# EAGLE design Steuerung (EAGLE 9.6.2)

## Sheet 1 of 3: Controller / Display
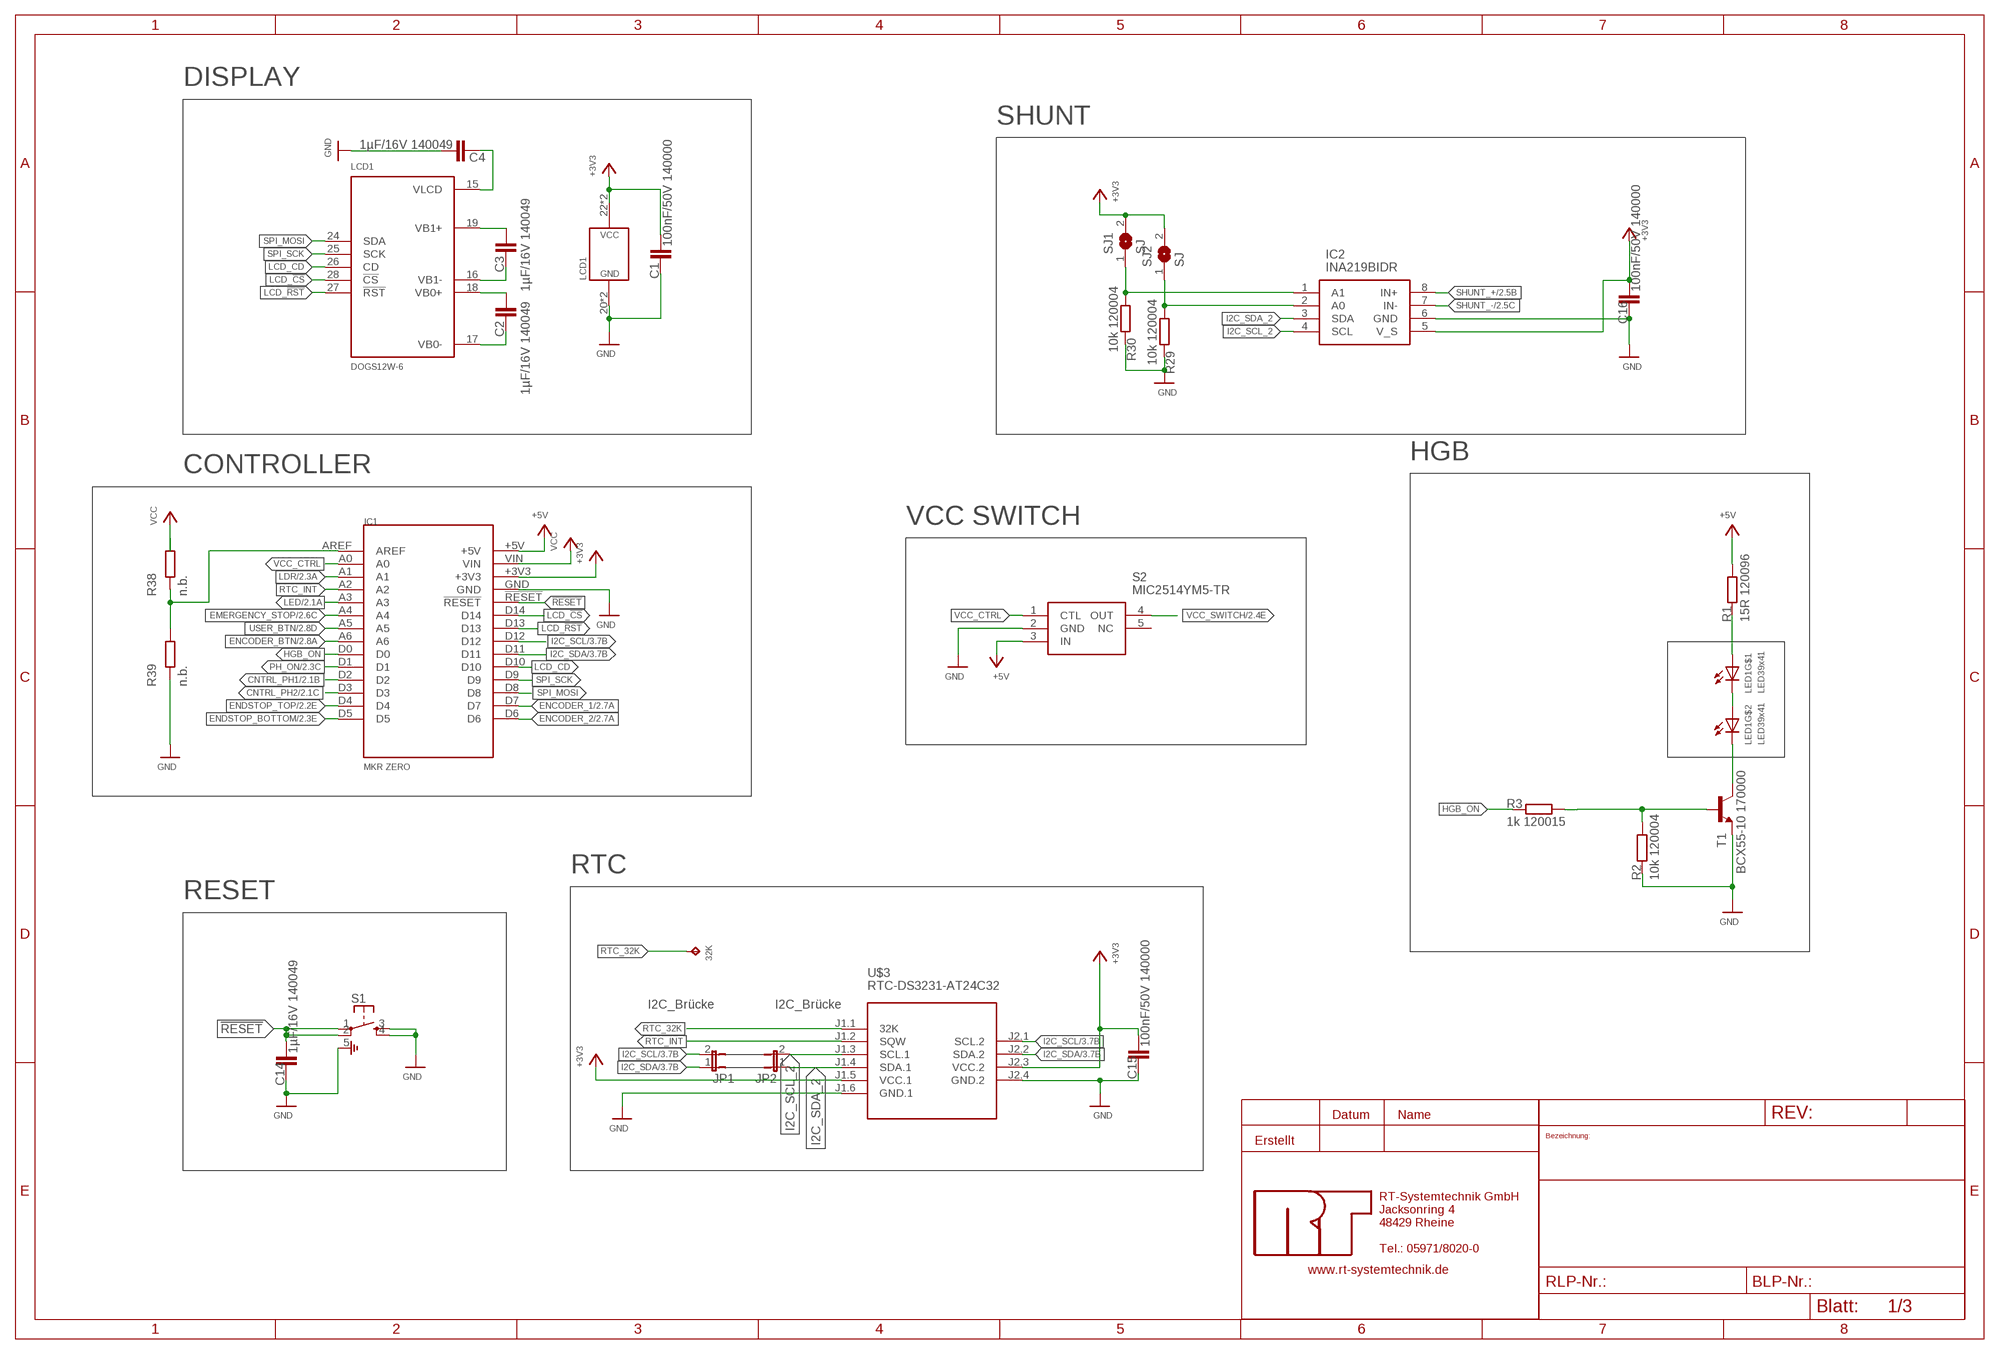
[diagram p0: schematic, sheet 1]

### Parts
32K  PAD_SMD_2,5X1  [SMD_2,5X1]
C1  100nF/50V 140000  C-EUC0805  [C0805]
C2  1µF/16V 140049  C-EUC0805  [C0805]
C3  1µF/16V 140049  C-EUC0805  [C0805]
C4  1µF/16V 140049  C-EUC0805  [C0805]
C14  1µF/16V 140049  C-EUC0805  [C0805]
C15  100nF/50V 140000  C-EUC0805  [C0805]
C16  100nF/50V 140000  C-EUC0805  [C0805]
FRAME1  A3L-LOC  [DOKUDATA]
IC1  MKR ZERO  MKR_ZERO  [MKR_ZERO]
IC2  INA219BIDR  [SOIC127P600X175-8N]
JP1  I2C_Brücke  JP1E  [JP1]
JP2  I2C_Brücke  JP1E  [JP1]
LCD1  DOGS12W-6  DOGS102-6  [DOGS_LCD_102X64]
LED1  LED39x41  LED39X41  [LED39X41]
R1  15R 120096  R-EU_R0805  [R0805]
R2  10k 120004  R-EU_R0805  [R0805]
R3  1k 120015  R-EU_R0805  [R0805]
R29  10k 120004  R-EU_R0805  [R0805]
R30  10k 120004  R-EU_R0805  [R0805]
R38  n.b.  R-EU_R0805  [R0805]
R39  n.b.  R-EU_R0805  [R0805]
S1  B3SN-3X12  [B3SN-3X12_SMD]
S2  MIC2514YM5-TR  [SOT95P280X130-5N]
SJ1  SJ  [SJ]
SJ2  SJ  [SJ]
T1  BCX55-10 170000  BCX55-NPN-SOT89-BCE  [SOT89-BCE]
U$3  RTC-DS3231-AT24C32  [RTC-DS3231-AT24C32]

### Nets
!RESET: C14.1 IC1.!RESET S1.1(P) S1.2(P1)
+3V3: C1.1 C15.1 C16.1 IC1.+3V3 IC2.5(V_S) LCD1.22(VCC) LCD1.23(VCC) SJ1.2 SJ2.2 U$3.J1.5(VCC.1) U$3.J2.3(VCC.2) ; also sheet 2,3
+5V: IC1.+5V R1.1 S2.3(IN) ; also sheet 2
CNTRL_PH1: IC1.D2 ; also sheet 2
CNTRL_PH2: IC1.D3 ; also sheet 2
EMERGENCY_STOP: IC1.A4 ; also sheet 2
ENCODER_1: IC1.D7 ; also sheet 2
ENCODER_2: IC1.D6 ; also sheet 2
ENCODER_BTN: IC1.A6 ; also sheet 2
ENDSTOP_BOTTOM: IC1.D5 ; also sheet 2
ENDSTOP_TOP: IC1.D4 ; also sheet 2
GND: C1.2 C4.1 C14.2 C15.2 C16.2 IC1.GND IC2.6(GND) LCD1.20(GND) LCD1.21(GND) R2.2 R29.1 R30.1 R39.2 S1.3(S) S1.4(S1) S1.5 S2.2(GND) T1.E U$3.J1.6(GND.1) U$3.J2.4(GND.2) ; also sheet 2,3
HGB_ON: IC1.D0 R3.2
I2C_SCL: IC1.D12 JP1.2 U$3.J2.1(SCL.2) ; also sheet 3
I2C_SCL_2: IC2.4(SCL) JP2.2 U$3.J1.3(SCL.1)
I2C_SDA: IC1.D11 JP1.1 U$3.J2.2(SDA.2) ; also sheet 3
I2C_SDA_2: IC2.3(SDA) JP2.1 U$3.J1.4(SDA.1)
LCD_!CS: IC1.D14 LCD1.28(!CS)
LCD_!RST: IC1.D13 LCD1.27(!RST)
LCD_CD: IC1.D10 LCD1.26(CD)
LDR: IC1.A1 ; also sheet 2
LED: IC1.A3 ; also sheet 2
N$3: C3.1 LCD1.19(VB1+)
N$4: C3.2 LCD1.16(VB1-)
N$5: C2.1 LCD1.18(VB0+)
N$6: C2.2 LCD1.17(VB0-)
N$7: C4.2 LCD1.15(VLCD)
N$8: LED1.2(C) LED1.14(A)
N$9: LED1.1(A) R1.2
N$10: LED1.13(C) T1.C
N$11: R2.1 R3.1 T1.B
N$24: IC2.1(A1) R30.2 SJ1.1
N$25: IC2.2(A0) R29.2 SJ2.1
N$34: IC1.AREF R38.2 R39.1
PH_ON: IC1.D1 ; also sheet 2
RTC_32K: 32K.PIN1(PAD) U$3.J1.1(32K)
RTC_INT: IC1.A2 U$3.J1.2(SQW)
SHUNT_+: IC2.8(IN+) ; also sheet 2
SHUNT_-: IC2.7(IN-) ; also sheet 2
SPI_MOSI: IC1.D8 LCD1.24(SDA)
SPI_SCK: IC1.D9 LCD1.25(SCK)
USER_BTN: IC1.A5 ; also sheet 2
VCC: IC1.VIN R38.1 ; also sheet 3
VCC_CTRL: IC1.A0 S2.1(CTL)
VCC_SWITCH: S2.4(OUT) ; also sheet 2
Unconnected: S2.5(NC)

### Notes on the sheet
- DISPLAY
- SHUNT
- HGB
- CONTROLLER
- VCC SWITCH
- RTC
- RESET

## Sheet 2 of 3: IO
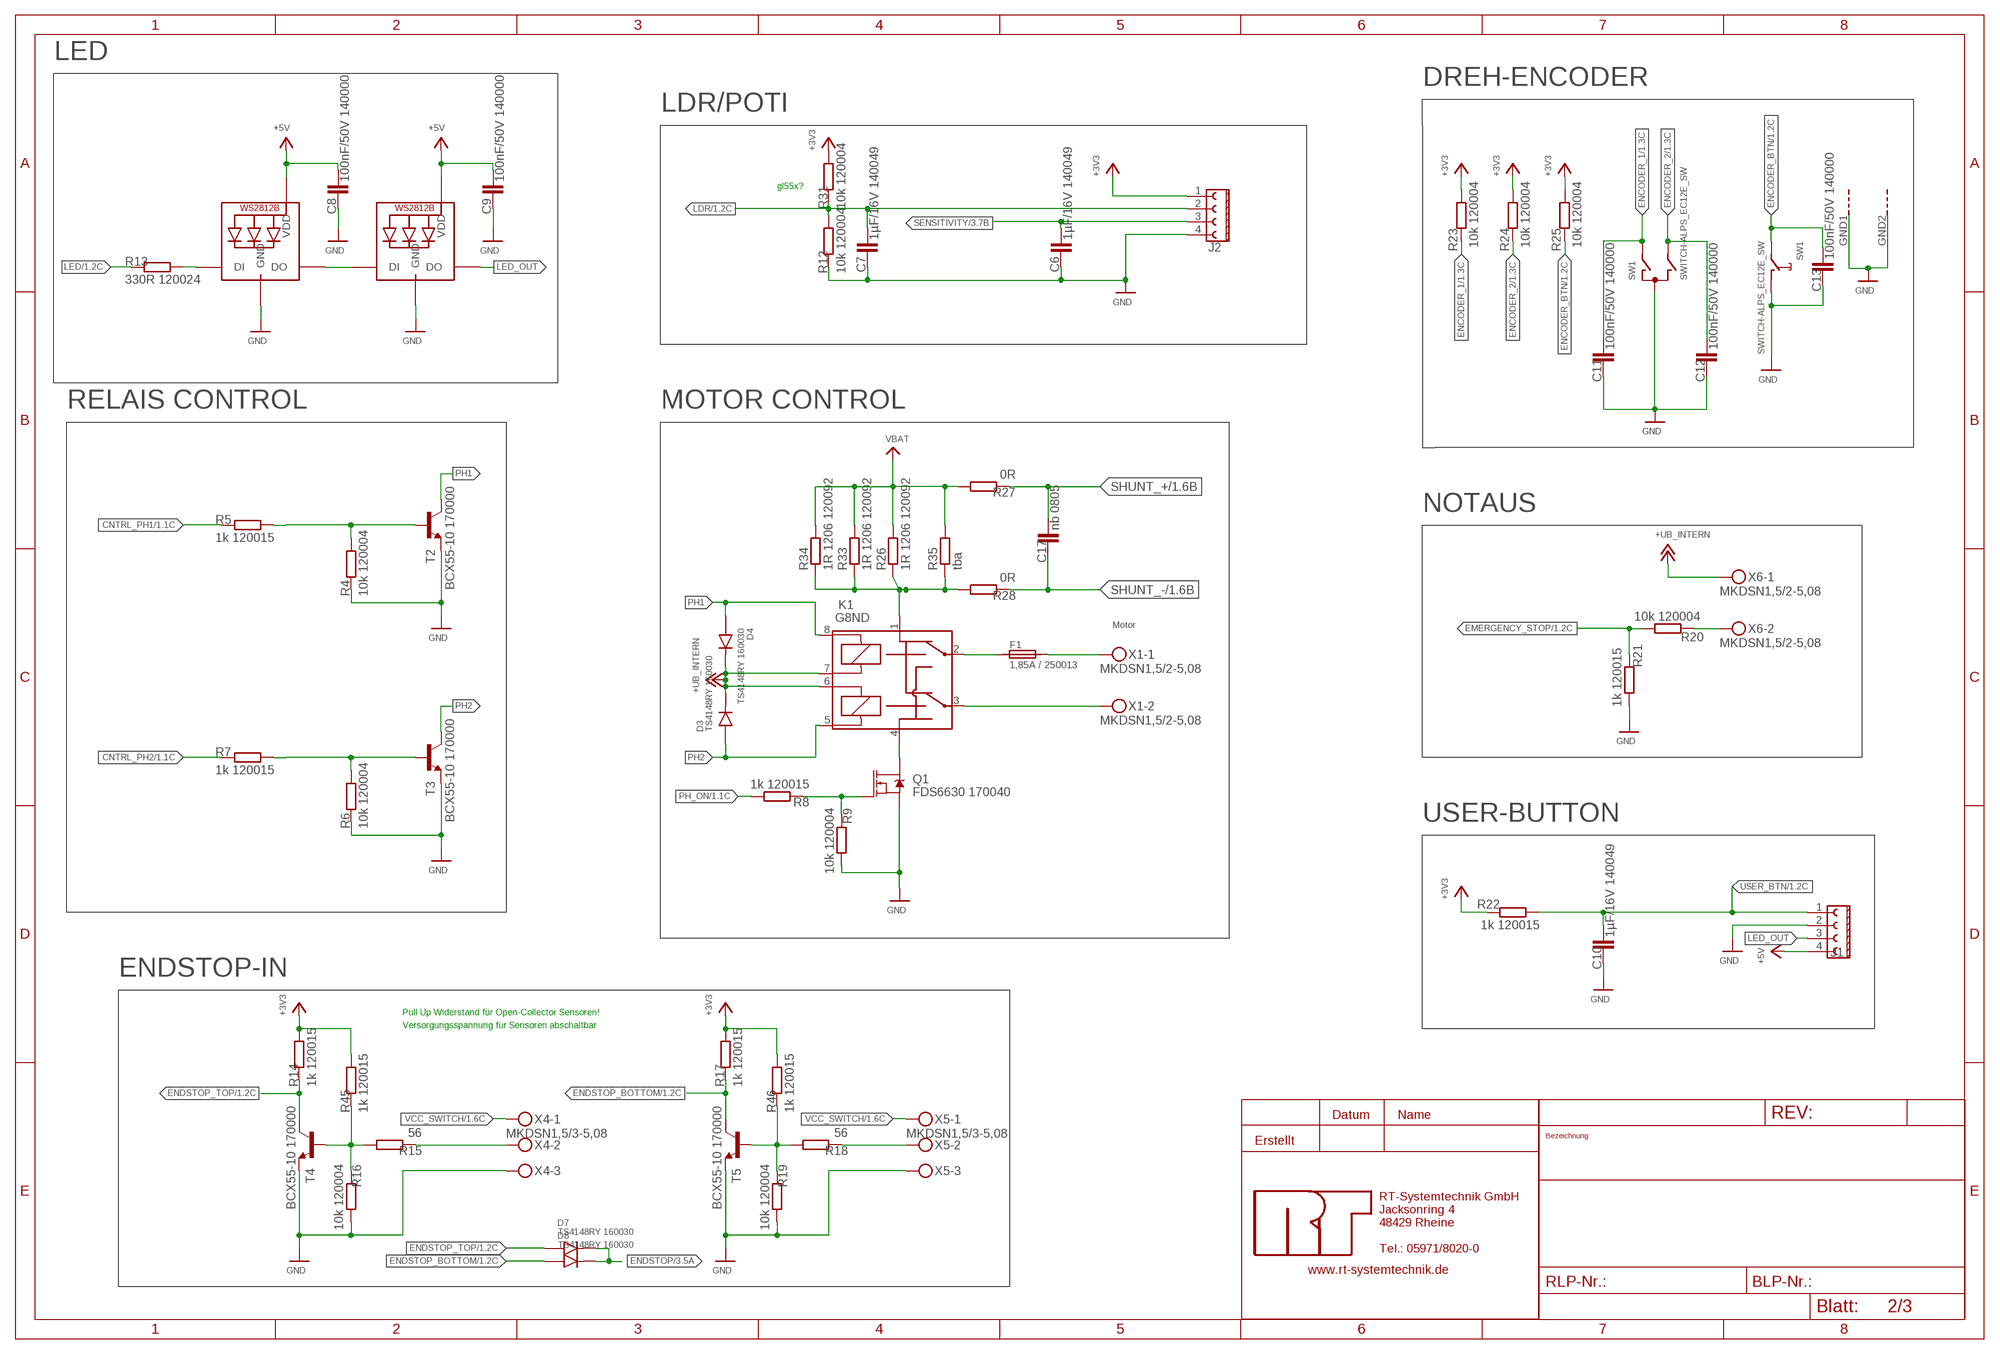
[diagram p1: schematic, sheet 2]

### Parts
C6  1µF/16V 140049  C-EUC0805  [C0805]
C7  1µF/16V 140049  C-EUC0805  [C0805]
C8  100nF/50V 140000  C-EUC0805  [C0805]
C9  100nF/50V 140000  C-EUC0805  [C0805]
C10  1µF/16V 140049  C-EUC0805  [C0805]
C11  100nF/50V 140000  C-EUC0805  [C0805]
C12  100nF/50V 140000  C-EUC0805  [C0805]
C13  100nF/50V 140000  C-EUC0805  [C0805]
C17  nb 0805  C-EUC0805  [C0805]
D3  TS4148RY 160030  TS4148RY  [R1206]
D4  TS4148RY 160030  TS4148RY  [R1206]
D7  TS4148RY 160030  TS4148RY  [R1206]
D8  TS4148RY 160030  TS4148RY  [R1206]
F1  1,85A / 250013  SMD_POLY_2920  [SMD2920]
FRAME2  A3L-LOC  [DOKUDATA]
J1  CONNECTORS_JST-4  [CONNECTORS_EXH_PRN_H_INV]
J2  CONNECTORS_JST-4  [CONNECTORS_EXH_PRN_H_INV]
K1  G8ND  RELAYS_OMRON_G8ND2  [RELAYS_OMRON_G8ND2]
LED2  WS2812B5050  [WS2812B]
LED3  WS2812B5050  [WS2812B]
Q1  FDS6630 170040  MOSFET-NCH-FDS6630A  [SO08]
R4  10k 120004  R-EU_R0805  [R0805]
R5  1k 120015  R-EU_R0805  [R0805]
R6  10k 120004  R-EU_R0805  [R0805]
R7  1k 120015  R-EU_R0805  [R0805]
R8  1k 120015  R-EU_R0805  [R0805]
R9  10k 120004  R-EU_R0805  [R0805]
R12  10k 120004  R-EU_R0805  [R0805]
R13  330R 120024  R-EU_R0805  [R0805]
R14  1k 120015  R-EU_R0805  [R0805]
R15  56  R-EU_R0805  [R0805]
R16  10k 120004  R-EU_R0805  [R0805]
R17  1k 120015  R-EU_R0805  [R0805]
R18  56  R-EU_R0805  [R0805]
R19  10k 120004  R-EU_R0805  [R0805]
R20  10k 120004  R-EU_R0805  [R0805]
R21  1k 120015  R-EU_R0805  [R0805]
R22  1k 120015  R-EU_R0805  [R0805]
R23  10k 120004  R-EU_R0805  [R0805]
R24  10k 120004  R-EU_R0805  [R0805]
R25  10k 120004  R-EU_R0805  [R0805]
R26  1R 1206 120092  R-EU_R1206W  [R1206W]
R27  0R  R-EU_R0805  [R0805]
R28  0R  R-EU_R0805  [R0805]
R31  10k 120004  R-EU_R0805  [R0805]
R33  1R 1206 120092  R-EU_R1206W  [R1206W]
R34  1R 1206 120092  R-EU_R1206W  [R1206W]
R35  tba  R-EU_0207/7  [0207/7]
R45  1k 120015  R-EU_R0805  [R0805]
R46  1k 120015  R-EU_R0805  [R0805]
SW1  SWITCH-ALPS_EC12E_SW  [SWITCH-ALPS_ALPS_EC12E_SW]
T2  BCX55-10 170000  BCX55-NPN-SOT89-BCE  [SOT89-BCE]
T3  BCX55-10 170000  BCX55-NPN-SOT89-BCE  [SOT89-BCE]
T4  BCX55-10 170000  BCX55-NPN-SOT89-BCE  [SOT89-BCE]
T5  BCX55-10 170000  BCX55-NPN-SOT89-BCE  [SOT89-BCE]
X1  MKDSN1,5/2-5,08  [MKDSN1,5/2-5,08]
X4  MKDSN1,5/3-5,08  [MKDSN1,5/3-5,08]
X5  MKDSN1,5/3-5,08  [MKDSN1,5/3-5,08]
X6  MKDSN1,5/2-5,08  [MKDSN1,5/2-5,08]

### Nets
+3V3: J2.1 R14.1 R17.1 R22.2 R23.1 R24.1 R25.1 R31.1 R45.1 R46.1 ; also sheet 1,3
+5V: C8.1 C9.1 J1.4 LED2.1-VDD(VDD) LED3.1-VDD(VDD) ; also sheet 1
+UB_INTERN: D3.2(C) D4.2(C) K1.6(2SA) K1.7(1SB) X6.1 ; also sheet 3
CNTRL_PH1: R5.2 ; also sheet 1
CNTRL_PH2: R7.2 ; also sheet 1
EMERGENCY_STOP: R20.1 R21.2 ; also sheet 1
ENCODER_1: C11.1 R23.2 SW1.A ; also sheet 1
ENCODER_2: C12.1 R24.2 SW1.B ; also sheet 1
ENCODER_BTN: C13.1 R25.2 SW1.E ; also sheet 1
ENDSTOP: D7.2(C) D8.2(C) ; also sheet 3
ENDSTOP_BOTTOM: D8.1(A) R17.2 T5.C ; also sheet 1
ENDSTOP_TOP: D7.1(A) R14.2 T4.C ; also sheet 1
GND: C6.2 C7.2 C8.2 C9.2 C10.2 C11.2 C12.2 C13.2 J1.2 J2.4 LED2.3-GND(GND) LED3.3-GND(GND) Q1.1(S) Q1.2(S) Q1.3(S) R4.2 R6.2 R9.1 R12.2 R16.1 R19.1 R21.1 SW1.C SW1.D SW1.GND1(G) SW1.GND2(G) T2.E T3.E T4.E T5.E X4.3 X5.3 ; also sheet 1,3
LDR: C7.1 J2.2 R12.1 R31.2 ; also sheet 1
LED: R13.2 ; also sheet 1
LED_OUT: J1.3 LED3.2-DOUT(DO)
N$1: K1.4(O2) Q1.5(D) Q1.6(D) Q1.7(D) Q1.8(D)
N$2: Q1.4(G) R8.2 R9.2
N$12: R4.1 R5.1 T2.B
N$13: R6.1 R7.1 T3.B
N$14: K1.3(P2) X1.2
N$15: F1.1 K1.2(P1)
N$16: F1.2 X1.1
N$18: LED2.4-DIN(DI) R13.1
N$19: LED2.2-DOUT(DO) LED3.4-DIN(DI)
N$20: R15.1 R16.2 R45.2 T4.B
N$21: R15.2 X4.2
N$22: R18.1 R19.2 R46.2 T5.B
N$23: R18.2 X5.2
N$26: K1.1(O1) R26.1 R28.1 R33.1 R34.1 R35.1
N$27: R20.2 X6.2
PH1: D4.1(A) K1.8(1SA) T2.C
PH2: D3.1(A) K1.5(2SB) T3.C
PH_ON: R8.1 ; also sheet 1
SENSITIVITY: C6.1 J2.3 ; also sheet 3
SHUNT_+: C17.1 R27.2 ; also sheet 1
SHUNT_-: C17.2 R28.2 ; also sheet 1
USER_BTN: C10.1 J1.1 R22.1 ; also sheet 1
VBAT: R26.2 R27.1 R33.2 R34.2 R35.2 ; also sheet 3
VCC_SWITCH: X4.1 X5.1 ; also sheet 1

### Notes on the sheet
- LED
- DREH-ENCODER
- LDR/POTI
- gl55x?
- RELAIS CONTROL | MOTOR CONTROL
- NOTAUS
- Motor
- USER-BUTTON
- ENDSTOP-IN
- Pull Up Widerstand für Open-Collector Sensoren!
- Versorgungsspannung für Sensoren abschaltbar

## Sheet 3 of 3: Power
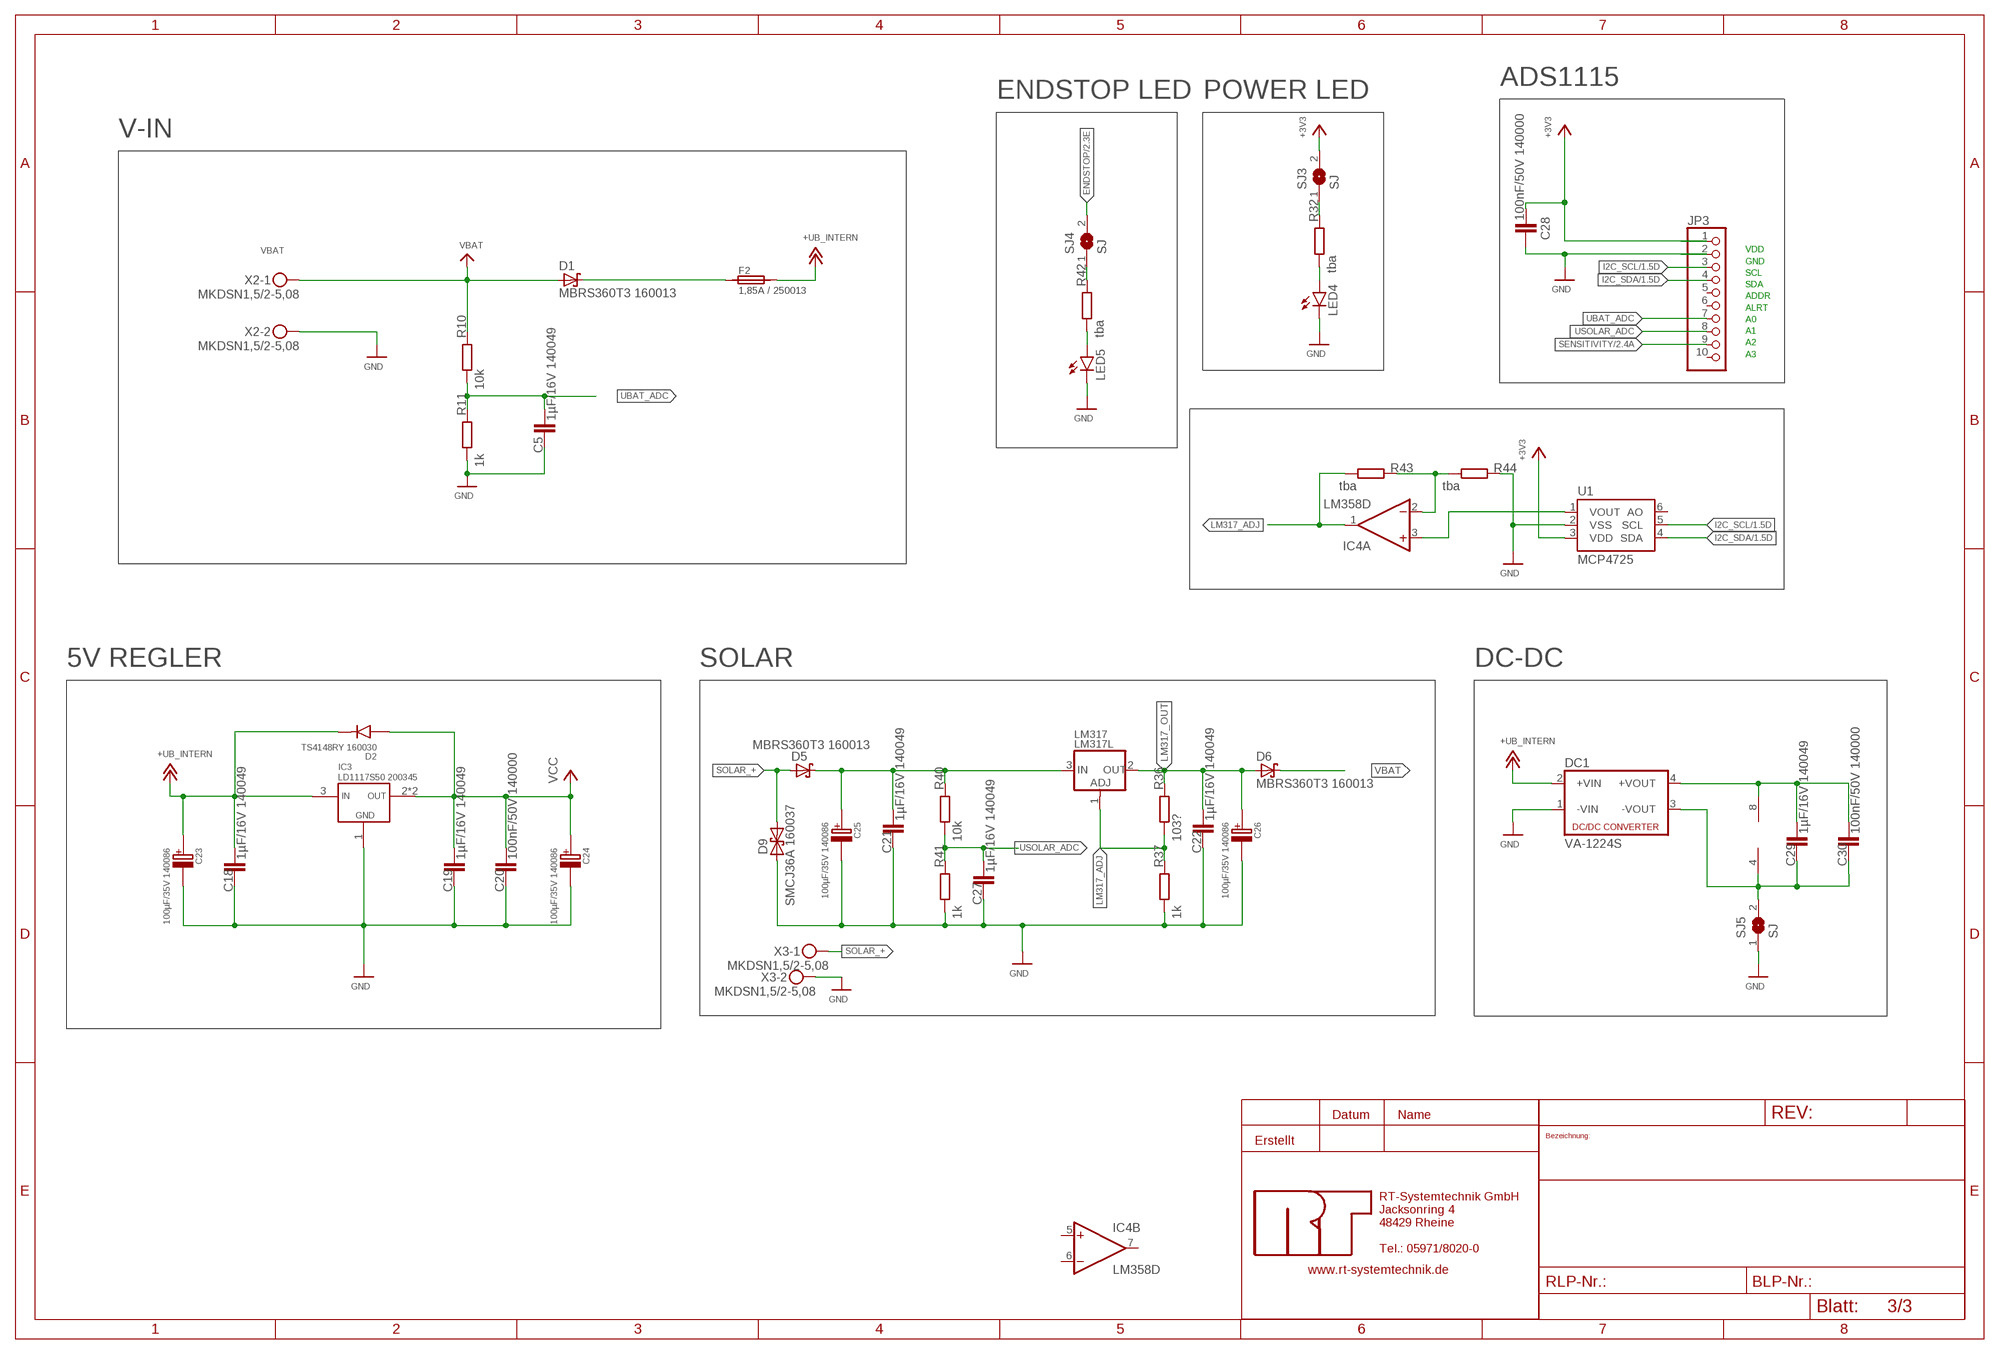
[diagram p2: schematic, sheet 3]

### Parts
C5  1µF/16V 140049  C-EUC0805  [C0805]
C18  1µF/16V 140049  C-EUC0805  [C0805]
C19  1µF/16V 140049  C-EUC0805  [C0805]
C20  100nF/50V 140000  C-EUC0805  [C0805]
C21  1µF/16V 140049  C-EUC0805  [C0805]
C22  1µF/16V 140049  C-EUC0805  [C0805]
C23  100µF/35V 140086  RCL_CPOL_E(CASE-D)-100UF/35V  [RCL_CE_D]
C24  100µF/35V 140086  RCL_CPOL_E(CASE-D)-100UF/35V  [RCL_CE_D]
C25  100µF/35V 140086  RCL_CPOL_E(CASE-D)-100UF/35V  [RCL_CE_D]
C26  100µF/35V 140086  RCL_CPOL_E(CASE-D)-100UF/35V  [RCL_CE_D]
C27  1µF/16V 140049  C-EUC0805  [C0805]
C28  100nF/50V 140000  C-EUC0805  [C0805]
C29  1µF/16V 140049  C-EUC0805  [C0805]
C30  100nF/50V 140000  C-EUC0805  [C0805]
D1  MBRS360T3 160013  ROLF_MBRS360T3  [ROLF_SMC]
D2  TS4148RY 160030  TS4148RY  [R1206]
D5  MBRS360T3 160013  ROLF_MBRS360T3  [ROLF_SMC]
D6  MBRS360T3 160013  ROLF_MBRS360T3  [ROLF_SMC]
D9  SMCJ36A 160037  SMCJ36CA  [SMC]
DC1  VA-1224S  [4SIL]
F2  1,85A / 250013  SMD_POLY_2920  [SMD2920]
FRAME3  A3L-LOC  [DOKUDATA]
IC3  LD1117S50 200345  SPANNUNGSREGLER_LD1117S50  [SPANNUNGSREGLER_SOT-223]
IC4  LM358D  [SO08]
JP3  PINHD-1X10  [1X10]
LED4  LEDCHIP-LED0805  [CHIP-LED0805]
LED5  LEDCHIP-LED0805  [CHIP-LED0805]
LM317  LM317L  [TO220L]
R10  10k  R-EU_R0805  [R0805]
R11  1k  R-EU_R0805  [R0805]
R32  tba  R-EU_R0805  [R0805]
R36  103?  R-EU_R0805  [R0805]
R37  1k  R-EU_R0805  [R0805]
R40  10k  R-EU_R0805  [R0805]
R41  1k  R-EU_R0805  [R0805]
R42  tba  R-EU_R0805  [R0805]
R43  tba  R-EU_R0805  [R0805]
R44  tba  R-EU_R0805  [R0805]
SJ3  SJ  [SJ]
SJ4  SJ  [SJ]
SJ5  SJ  [SJ]
U1  MCP4725  MCP4725SOT-23  [SOT23-6]
X2  MKDSN1,5/2-5,08  [MKDSN1,5/2-5,08]
X3  MKDSN1,5/2-5,08  [MKDSN1,5/2-5,08]

### Nets
+3V3: C28.1 JP3.1 SJ3.2 U1.3(VDD) ; also sheet 1,2
+UB_INTERN: C18.1 C23.+ D2.2(C) DC1.2(+VIN) F2.2 IC3.3(IN) ; also sheet 2
ENDSTOP: SJ4.2 ; also sheet 2
GND: C5.2 C18.2 C19.2 C20.2 C21.2 C22.2 C23.- C24.- C25.- C26.- C27.2 C28.2 D9.A DC1.1(-VIN) IC3.1(GND) JP3.2 LED4.C LED5.C R11.2 R37.2 R41.2 R44.1 U1.2(VSS) X2.2 X3.2 ; also sheet 1,2
I2C_SCL: JP3.3 U1.5(SCL) ; also sheet 1
I2C_SDA: JP3.4 U1.4(SDA) ; also sheet 1
LM317_ADJ: IC4.1(A:OUT) LM317.1(ADJ) R36.2 R37.1 R43.2
LM317_OUT: C22.1 C26.+ D6.A LM317.2(OUT) R36.1
N$17: D1.K F2.1
N$28: LED4.A R32.2
N$29: C21.1 C25.+ D5.K LM317.3(IN) R40.1
N$30: R32.1 SJ3.1
N$31: IC4.3(A:+IN) U1.1(VOUT)
N$32: LED5.A R42.2
N$33: R42.1 SJ4.1
N$35: C29.1 C30.1 DC1.4(+VOUT) IC4.8(P:V+)
N$36: IC4.2(A:-IN) R43.1 R44.2
N$37: C29.2 C30.2 DC1.3(-VOUT) IC4.4(P:V-) SJ5.2
N$38: SJ5.1 ; supply symbol labelled GND
SENSITIVITY: JP3.9 ; also sheet 2
SOLAR_+: D5.A D9.C X3.1
UBAT_ADC: C5.1 JP3.7 R10.2 R11.1
USOLAR_ADC: C27.1 JP3.8 R40.2 R41.1
VBAT: D1.A D6.K R10.1 X2.1 ; also sheet 2
VCC: C19.1 C20.1 C24.+ D2.1(A) IC3.2(OUT) IC3.4(OUT) ; also sheet 1
Unconnected: IC4.5(B:+IN) IC4.6(B:-IN) IC4.7(B:OUT) JP3.5 JP3.6 JP3.10 U1.6(AO)

### Notes on the sheet
- ADS1115
- ENDSTOP LED | POWER LED
- V-IN
- VBAT
- VDD
  GND
  SCL
  SDA
  ADDR
  ALRT
  A0
  A1
  A2
  A3
- 5V REGLER | SOLAR | DC-DC

## Library data of the parts
32K = Sonstiges:PAD_
C1-C22 C27-C30 = rcl:C-EU: CAPACITOR, European symbol; SPICEPREFIX: C
C23-C26 = Interface_Klimaschrank:RCL_CPOL_?-*: Kondensatoren, gepolt; RT: 140105; VALUE: 100µF/35V
D1 D5 D6 = DCU_Aktive_Erw:ROLF_MBRS360T3
D2-D4 D7 D8 = Fabian:TS4148RY
D9 = 67017:SMCJ36CA
DC1 = dc-dc-converter:VA-*?: DC DC Converter Single Output, 1 Watt Motien Technology Co.,Ltd. Source: va-serie.pdf; OC_FARNELL: unknown; OC_NEWARK: unknown
F1 F2 = Joerg_Sonstiges:SMD_POLY_2920
FRAME1-FRAME3 = RT:A3L-LOC: A3 Rahmen Querformat DIN A3, Querformat; ULP zum ausfüllen: DOCFIELD
IC1 = Fabian:MKR_ZERO
IC2 = SamacSys_Parts:INA219BIDR: 26-V, Bidirectional, Zero-Drift, High-Side, I2C Out Current/Power Monitor Source: Datasheet <https://www.ti.com/lit/ds/symlink/ina219.pdf?HQS=TI-null-null-digikeymode-df-pf-null-wwe&ts=1601223553719>; DESCRIPTION: 26-V, Bidirectional, Zero-Drift, High-Side, I2C Out Current/Power Monitor; HEIGHT: 1.75mm; MANUFACTURER_NAME: Texas Instruments; MANUFACTURER_PART_NUMBER: INA219BIDR; MOUSER_PART_NUMBER: 595-INA219BIDR; MOUSER_PRICE-STOCK: https://www.mouser.co.uk/ProductDetail/Texas-Instruments/INA219BIDR?qs=1WmUhT%2FVMINyGsXNJcdD5Q%3D%3D
IC3 = Interface_Klimaschrank:SPANNUNGSREGLER_LD1117?*
IC4 = linear:LM358: OP AMP also LM158; LM258; LM2904 Source: http://cache.national.com/ds/LM/LM158.pdf
J1 J2 = LCC2:CONNECTORS_JST-4: 4 pin JST connector
JP1 JP2 = jumper:JP1E: JUMPER
JP3 = pinhead:PINHD-1X10: PIN HEADER
K1 = LCC2:RELAYS_OMRON_G8ND2: OMRON relay
LCD1 = Optoelektronik:DOGS102-6: EADOGS102-6 mit Hintergrundbeleuchtung EA LED39X41-A
LED1 = Optoelektronik:LED39X41
LED2 LED3 = adafruit:WS2812B
LED4 LED5 = led:LED: LED OSRAM: - CHIPLED LG R971, LG N971, LY N971, LG Q971, LY Q971, LO R971, LY R971 LH N974, LH R974 LS Q976, LO Q976, LY Q976 LO Q996 - Hyper CHIPLED LW Q18S LB Q993, LB Q99A, LB R99A - SideLED LS A670, LO A670, LY A670, LG A670, LP A670 LB A673, LV A673, LT A673, LW A673 LH A674 LY A675 LS A676, LA A676, LO A676, LY A676, LW A676 LS A679, LY A679, LG A679 - Hyper Micro SIDELED® LS Y876, LA Y876, LO Y876, LY Y876 LT Y87S - SmartLED LW L88C, LW L88S LB L89C, LB L89S, LG L890 LS L89K, LO L89K, LY L89K LS L896, LA L896, LO L896, LY L896 - TOPLED LS T670, LO T670, LY T670, LG T670, LP T670 LSG T670, LSP T670, LSY T670, LOP T670, LYG T670 LG T671, LOG T671, LSG T671 LB T673, LV T673, LT T673, LW T673 LH T674 LS T676, LA T676, LO T676, LY T676, LB T676, LH T676, LSB T676, LW T676 LB T67C, LV T67C, LT T67C, LS T67K, LO T67K, LY T67K, LW E67C LS E67B, LA E67B, LO E67B, LY E67B, LB E67C, LV E67C, LT E67C LW T67C LS T679, LY T679, LG T679 LS T770, LO T770, LY T770, LG T770, LP T770 LB T773, LV T773, LT T773, LW T773 LH T774 LS E675, LA E675, LY E675, LS T675 LS T776, LA T776, LO T776, LY T776, LB T776 LHGB T686 LT T68C, LB T68C - Hyper Mini TOPLED® LB M676 - Mini TOPLED Santana® LG M470 LS M47K, LO M47K, LY M47K Source: http://www.osram.convergy.de LUXEON: - LUMILED® LXK2-PW12-R00, LXK2-PW12-S00, LXK2-PW14-U00, LXK2-PW14-V00 LXK2-PM12-R00, LXK2-PM12-S00, LXK2-PM14-U00 LXK2-PE12-Q00, LXK2-PE12-R00, LXK2-PE12-S00, LXK2-PE14-T00, LXK2-PE14-U00 LXK2-PB12-K00, LXK2-PB12-L00, LXK2-PB12-M00, LXK2-PB14-N00, LXK2-PB14-P00, LXK2-PB14-Q00 LXK2-PR12-L00, LXK2-PR12-M00, LXK2-PR14-Q00, LXK2-PR14-R00 LXK2-PD12-Q00, LXK2-PD12-R00, LXK2-PD12-S00 LXK2-PH12-R00, LXK2-PH12-S00 LXK2-PL12-P00, LXK2-PL12-Q00, LXK2-PL12-R00 Source: www.luxeon.com KINGBRIGHT: KA-3528ASYC Source: www.kingbright.com
LM317 = ic:LM317: LM317: Adjustable voltage regulator 3 pins, 1.2-37V, 1.5A (SMD version: 0.5A)
Q1 = SparkFun-DiscreteSemi:MOSFET-NCH: N-channel MOSFETs Voltage controlled devices that allow control of high current outputs. SparkFun Products: SparkFun OpenScale <https://www.sparkfun.com/products/13261> SparkFun Digital Sandbox <https://www.sparkfun.com/products/12651> SparkFun Monster Moto Shield <https://www.sparkfun.com/products/10182> SparkFun MOSFET Power Controller <https://www.sparkfun.com/products/11214>; PROD_ID: TRANS-08089; VALUE: 6.5A/30V/38mΩ
R1-R46 = rcl:R-EU_: RESISTOR, European symbol; SPICEPREFIX: R
S1 = Joerg_Schalter&Taster:B3SN-3X12
S2 = SamacSys_Parts:MIC2514YM5-TR: MICROCHIP - MIC2514YM5-TR - IC, SWITCH, HIGH SIDE, TTL INPUT Source: Datasheet <https://componentsearchengine.com/Datasheets/2/MIC2514YM5-TR.pdf>; DESCRIPTION: MICROCHIP - MIC2514YM5-TR - IC, SWITCH, HIGH SIDE, TTL INPUT; HEIGHT: 1.3mm; MANUFACTURER_NAME: Microchip; MANUFACTURER_PART_NUMBER: MIC2514YM5-TR; MOUSER_PART_NUMBER: 998-MIC2514YM5TR; MOUSER_PRICE-STOCK: https://www.mouser.co.uk/ProductDetail/Microchip-Technology-Micrel/MIC2514YM5-TR?qs=Y3Q3JoKAO1Tdv7qkmPTpGQ%3D%3D
SJ1-SJ5 = jumper:SJ: SMD solder JUMPER
SW1 = Interface_Klimaschrank:SWITCH-ALPS_EC12E_SW: ALPS rotary Encoder EC12E series with switch; MPN: EC12E2424407; OC_FARNELL: 1520813; OC_NEWARK: 74M1068
T1-T5 = transistor:*-NPN-: NPN Transistror BF959 corrected 2008.03.06
U1 = SparkFun-IC-Conversion:MCP4725: MCP4725 DAC Microchip 12-bit I2C DAC, SOT23-6 Datasheet <https://cdn.sparkfun.com/datasheets/BreakoutBoards/MCP4725_2009.pdf> SparkFun Products SparkFun I2C DAC Breakout - MCP4725 <https://www.sparkfun.com/products/12918> (BOB-12918); PROD_ID: IC-08886
U$3 = diy-modules:RTC-DS3231-AT24C32: RTC Module with Battery and EEPROM based on DS3231 and AT24C32 chips Tutorial can be found here: https://edwardmallon.wordpress.com/2014/05/21/using-a-cheap-3-ds3231-rtc-at24c32-eeprom-from-ebay/ Click here to find device on ebay.com <http://www.ebay.com/sch/DS3231+AT24C32+module>
X1-X3 X6 = con-phoenix-508:MKDSN1,5/2-5,08: MKDSN 1,5/ 2-5,08 Printklemme Nennstrom: 13,5 A Nennspannung: 250 V Rastermaß: 5,08 mm Polzahl: 2 Anschlussart: Schraubanschluss Montage: Löten Anschlussrichtung Leiter/Platine: 0 ° Artikelnummer: 1729128 Source: http://eshop.phoenixcontact.com .. 1729128.pdf
X4 X5 = con-phoenix-508:MKDSN1,5/3-5,08: MKDSN 1,5/ 3-5,08 Printklemme Nennstrom: 13,5 A Nennspannung: 250 V Rastermaß: 5,08 mm Polzahl: 3 Anschlussart: Schraubanschluss Montage: Löten Anschlussrichtung Leiter/Platine: 0 ° Artikelnummer: 1729131 Source: http://eshop.phoenixcontact.com .. 1729131.pdf

## Board
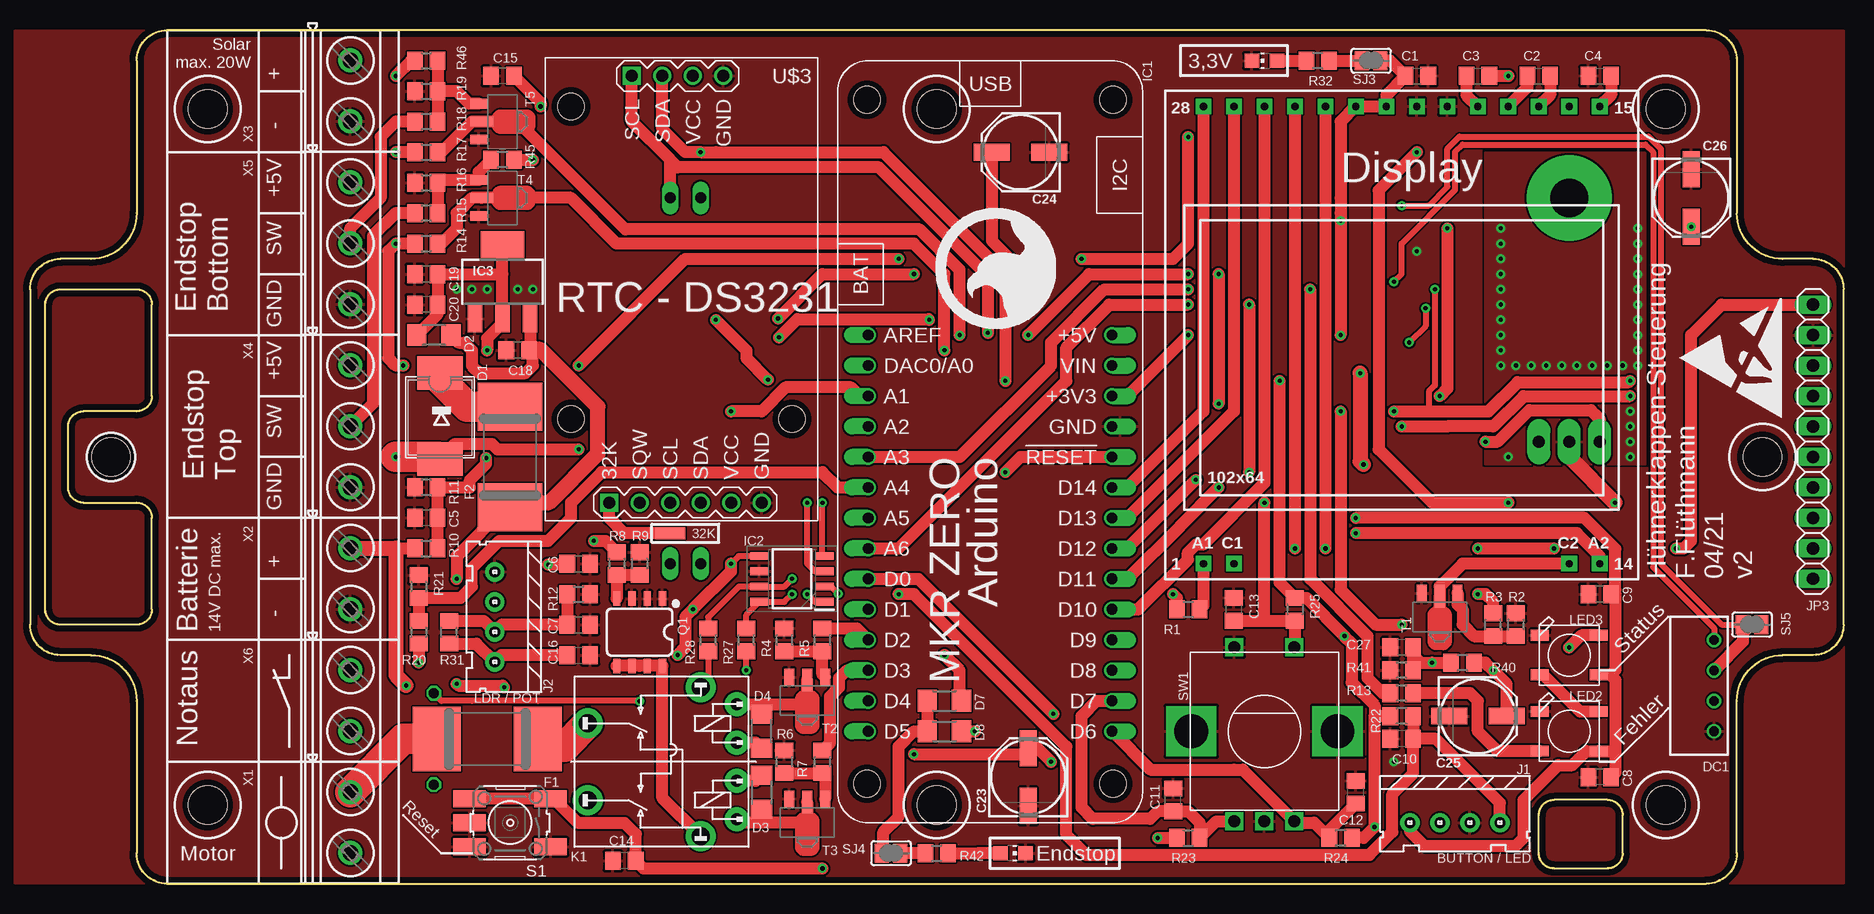
[diagram p3: board, top side]
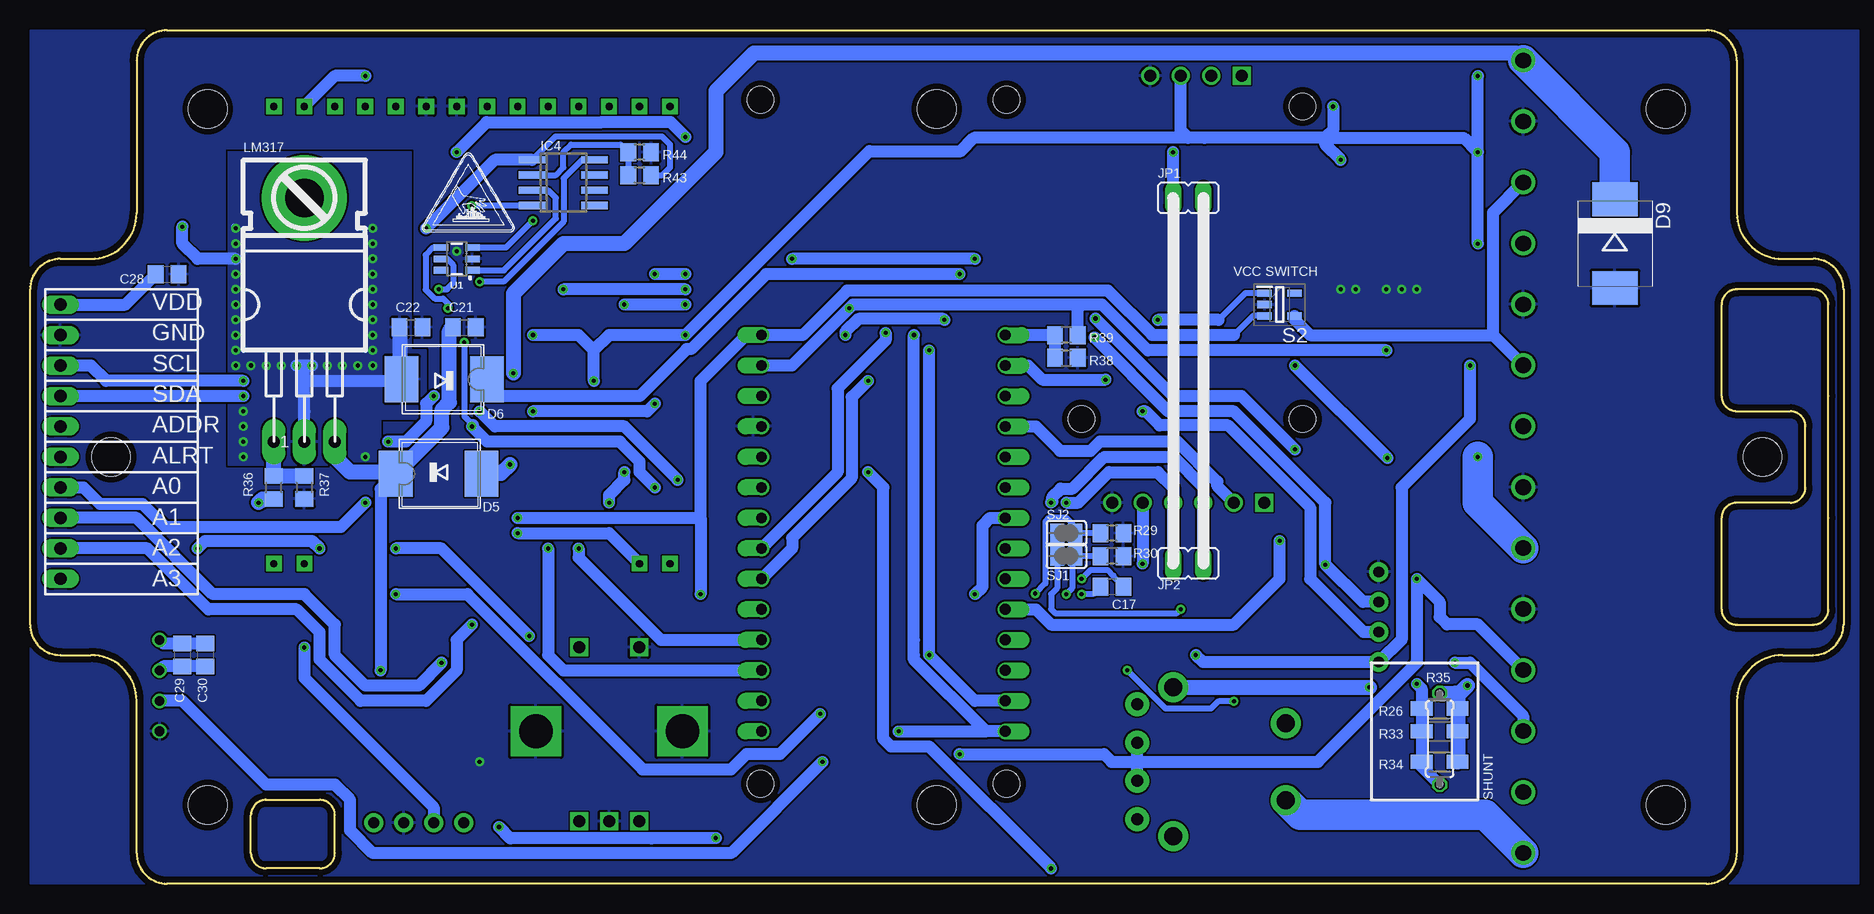
[diagram p4: board, bottom side, seen from below]

Size 151.13 x 71.12 mm. Coordinates in mm from the lower left corner, seen from the top.
Outline: 11.43,0 139.7,0 arc90 142.24,2.54 142.24,15.24 arc-90 146.05,19.05 148.59,19.05 arc90 151.13,21.59 151.13,49.53 arc90 148.59,52.07 146.05,52.07 arc-90 142.24,55.88 142.24,68.58 arc90 139.7,71.12 11.43,71.12 arc90 8.89,68.58 8.89,55.88 arc-90 5.08,52.07 2.54,52.07 arc90 0,49.53 0,21.59 arc90 2.54,19.05 5.08,19.05 arc-90 8.89,15.24 8.89,2.54 arc90 11.43,0
Outline: 8.89,21.59 2.54,21.59 arc-90 1.27,22.86 1.27,30.48 1.27,40.64 1.27,48.26 arc-90 2.54,49.53 8.89,49.53 arc-90 10.16,48.26 10.16,40.64 arc-90 8.89,39.37 4.45,39.37 arc90 3.17,38.1 3.17,33.02 arc90 4.45,31.75 8.89,31.75 arc-90 10.16,30.48 10.16,22.86 arc-90 8.89,21.59
Outline: 125.73,5.71 arc-90 127,6.99 131.44,6.99 arc-90 132.72,5.71 132.72,2.54 arc-90 131.44,1.27 127,1.27 arc-90 125.73,2.54 125.73,5.71
Copper layers (1*16): Top 0.018mm / dielectric 1.55mm / Bottom 0.018mm
Design rules "Standard_2Layer": minimum track width 0.15mm, minimum drill 0.25mm, track to track 0.15mm, track to pad 0.15mm, pad to pad 0.15mm, via to via 0.15mm, smd to smd 0mil, copper to edge 0.5mm, drill to drill 0.35mm, minimum pad ring 0.175mm, minimum via ring 0.2mm, stop-mask expansion 0mil, vias tented up to drill 0.4mm, thermal gap 0.2mm
Holes 3.2 mm at 6.75,35.56 144.38,35.56 136.31,64.56 75.56,6.56 75.56,64.56 14.81,64.56 14.81,6.56 136.31,6.56

### Footprints (pad centres in the part's own frame; a part is rotated, then mirrored left to right if it is on the bottom)
SMD_2,5X1 = smd 2.5 x 1: PIN1 0,0
C0805 = smd 1.3 x 1.5: 1 -0.95,0; 2 0.95,0
RCL_CE_D = smd 3 x 1.4: + 2.4,0; - -2.4,0
ROLF_SMC = smd 2.794 x 3.81: A 3.327,-0.127; K -3.81,-0.127
R1206 = smd 1.6 x 1.803: 1 -1.422,0; 2 1.422,0
SMC = smd 2.8 x 3.8: A 3.7,0; C -3.7,0
4SIL = drill 0.8: 1 -3.81,0; 2 -1.27,0; 3 1.27,0; 4 3.81,0
SMD2920 = smd 4 x 5.4: 1 -4.2,0; 2 4.2,0
MKR_ZERO = drill 0.9 offset: !RESET 1.27,10.16; +3V3 -3.81,10.16; +5V -8.89,10.16; A0 -6.35,-10.16; A1 -3.81,-10.16; A2 -1.27,-10.16; A3 1.27,-10.16; A4 3.81,-10.16; A5 6.35,-10.16; A6 8.89,-10.16; AREF -8.89,-10.16; D0 11.43,-10.16; D1 13.97,-10.16; D2 16.51,-10.16; D3 19.05,-10.16; D4 21.59,-10.16; D5 24.13,-10.16; D6 24.13,10.16; D7 21.59,10.16; D8 19.05,10.16; D9 16.51,10.16; D10 13.97,10.16; D11 11.43,10.16; D12 8.89,10.16; D13 6.35,10.16; D14 3.81,10.16; GND -1.27,10.16; VIN -6.35,10.16 | hole 2.2: -28.5,-10.25; 28.5,-10.25; 28.5,10.25; -28.5,10.25
SOIC127P600X175-8N = smd 1.528 x 0.65: 1 -2.711,1.905; 2 -2.711,0.635; 3 -2.711,-0.635; 4 -2.711,-1.905; 5 2.711,-1.905; 6 2.711,-0.635; 7 2.711,0.635; 8 2.711,1.905
SPANNUNGSREGLER_SOT-223 = smd 1.2 x 2.25: 1 -2.3,-3.1; 2 0,-3.1; 3 2.3,-3.1 | smd 3.6 x 2.2: 4 0,3.099
SO08 = smd 0.6 x 2.2: 1 -1.905,-2.6; 2 -0.635,-2.6; 3 0.635,-2.6; 4 1.905,-2.6; 5 1.905,2.6; 6 0.635,2.6; 7 -0.635,2.6; 8 -1.905,2.6
CONNECTORS_EXH_PRN_H_INV = drill 0.9 pad 1.6: 1 -3.75,0; 2 -1.25,0; 3 1.25,0; 4 3.75,0
JP1 = drill 0.914 long: 1 0,-1.27; 2 0,1.27
1X10 = drill 1.016 long: 1 -11.43,0; 2 -8.89,0; 3 -6.35,0; 4 -3.81,0; 5 -1.27,0; 6 1.27,0; 7 3.81,0; 8 6.35,0; 9 8.89,0; 10 11.43,0
RELAYS_OMRON_G8ND2 = drill 1.5 pad 2.5: 1 0,-6.2; 2 9.4,-3.2; 3 9.4,3.2; 4 0,6.2 | drill 1 pad 2: 5 -3,4.8; 6 -3,1.6; 7 -3,-1.6; 8 -3,-4.8
DOGS_LCD_102X64 = drill 0.6 pad 1.3 square: 15 16.51,21.59; 16 13.97,21.59; 17 11.43,21.59; 18 8.89,21.59; 19 6.35,21.59; 20 3.81,21.59; 21 1.27,21.59; 22 -1.27,21.59; 23 -3.81,21.59; 24 -6.35,21.59; 25 -8.89,21.59; 26 -11.43,21.59; 27 -13.97,21.59; 28 -16.51,21.59
LED39X41 = drill 0.6 pad 1.3 square: 1 -16.51,-16.51; 2 -13.97,-16.51; 13 13.97,-16.51; 14 16.51,-16.51
WS2812B = smd 1.5 x 0.9: 1-VDD 2.45,-1.65; 2-DOUT 2.45,1.65; 3-GND -2.45,1.65; 4-DIN -2.45,-1.65
CHIP-LED0805 = smd 1.2 x 1.2: A 0,-1.05; C 0,1.05
TO220L = drill 0.991 pad 1.905 long: 1 -2.54,0; 2 0,0; 3 2.54,0 | drill 3.2 pad 7.112: CASE 0,20.32
SO08' = smd 0.6 x 1.2: 1 -1.905,-2.8; 2 -0.635,-2.8; 3 0.635,-2.8; 4 1.905,-2.8; 5 1.905,2.8; 6 0.635,2.8; 7 -0.635,2.8; 8 -1.905,2.8
R0805 = smd 1.3 x 1.5: 1 -0.95,0; 2 0.95,0
R1206W = smd 1.8 x 1.2: 1 -1.499,0; 2 1.499,0
0207/7 = drill 0.813 octagon: 1 -3.81,0; 2 3.81,0
B3SN-3X12_SMD = smd 2.7 x 1.4: 1 3.375,-2; 2 -3.375,-2; 3 3.375,2; 4 -3.375,2; 5 3.375,0
SOT95P280X130-5N = smd 1.2 x 0.6: 1 -1.25,0.95; 2 -1.25,0; 3 -1.25,-0.95; 4 1.25,-0.95; 5 1.25,0.95
SJ = smd 1.168 x 1.6: 1 -0.762,0; 2 0.762,0
SWITCH-ALPS_ALPS_EC12E_SW = drill 1 square: A -2.5,-7.5; B 2.5,-7.5; C 0,-7.5; D -2.5,7; E 2.5,7 | drill 2.8 square: GND1 -6.1,0; GND2 6.1,0
SOT89-BCE = smd 0.8 x 1.4: B -1.499,-1.981; E 1.499,-1.981 | smd 0.8 x 1.9: C 0,-1.727
SOT23-6 = smd 0.55 x 1.2: 1 0.95,1.3; 2 0,1.3; 3 -0.95,1.3; 4 -0.95,-1.3; 5 0,-1.3; 6 0.95,-1.3
RTC-DS3231-AT24C32 = drill 1 square: J1.1 -17.78,6.35; J2.1 17.78,4.445 | drill 1: J1.2 -17.78,3.81; J1.3 -17.78,1.27; J1.4 -17.78,-1.27; J1.5 -17.78,-3.81; J1.6 -17.78,-6.35; J2.2 17.78,1.905; J2.3 17.78,-0.635; J2.4 17.78,-3.175 | hole 2.2: -10.795,-8.89; -10.795,9.525; 15.24,9.525
MKDSN1,5/2-5,08 = drill 1.3 pad 2: 1 -2.561,0.025; 2 2.519,0.025
MKDSN1,5/3-5,08 = drill 1.3 pad 2: 1 -7.641,0.025; 2 -2.561,0.025; 3 2.519,0.025

### Placement (x,y rotation side)
32K  53.34,29.21 180 top
C1  115.57,67.31 0 top
C2  125.73,67.31 0 top
C3  120.65,67.31 0 top
C4  130.81,67.31 0 top
C5  33.02,30.48 180 top
C6  45.72,26.67 0 top
C7  45.72,21.59 0 top
C8  130.81,8.89 180 top
C9  130.81,24.13 180 top
C10  114.3,12.06 180 top
C11  95.25,6.99 90 top
C12  110.49,7.62 90 top
C13  100.33,22.86 90 top
C14  49.53,1.91 180 top
C15  39.37,67.31 180 top
C16  45.72,19.05 0 top
C17  60.96,24.77 0 bottom
C18  40.64,44.45 180 top
C19  33.02,50.8 180 top
C20  33.02,48.26 180 top
C21  114.94,46.35 0 bottom
C22  119.38,46.35 0 bottom
C23  83.19,8.89 90 top
C24  82.55,60.96 180 top
C25  120.65,13.97 0 top
C26  138.43,57.15 270 top
C27  114.3,19.68 180 top
C28  139.7,50.8 0 bottom
C29  138.43,19.05 270 bottom
C30  136.53,19.05 270 bottom
D1  34.29,38.73 270 top
D2  33.66,45.72 0 top
D3  60.96,7.62 90 top
D4  60.96,12.7 270 top
D5  116.84,34.29 0 bottom
D6  116.84,41.91 180 bottom
D7  76.2,15.24 180 top
D8  76.2,12.7 180 top
D9  19.05,53.34 270 bottom
DC1  140.34,16.51 90 top
F1  38.1,12.06 180 top
F2  40.01,35.56 270 top
FRAME1  0,5.08 0 top
FRAME2  0,8.89 0 top
FRAME3  0,3.81 0 top
IC1  80.01,36.83 270 top
IC2  63.5,25.4 180 top
IC3  39.37,50.16 0 top
IC4  106.68,58.42 270 bottom
J1  118.75,5.08 180 top
J2  38.73,22.23 90 top
JP1  54.61,57.15 270 bottom
JP2  54.61,26.67 270 bottom
JP3  148.59,36.83 270 top
K1  55.88,10.16 180 top
LCD1  114.3,43.18 0 top
LED1  114.3,43.18 0 top
LED2  128.27,12.7 0 top
LED3  128.27,19.05 0 top
LED4  102.87,68.58 90 top
LED5  81.92,2.54 270 top
LM317  128.27,36.83 0 bottom
Q1  FDS6630 170040  [SO08']  50.8,20.95 180 top
R1  96.52,22.86 0 top
R2  123.83,21.59 90 top
R3  121.92,21.59 90 top
R4  62.87,20.32 90 top
R5  66.04,20.32 90 top
R6  62.87,10.16 90 top
R7  66.04,10.16 90 top
R8  48.9,26.67 270 top
R9  50.8,26.67 270 top
R10  33.02,27.94 0 top
R11  33.02,33.02 180 top
R12  45.72,24.13 0 top
R13  114.3,15.88 180 top
R14  33.02,53.34 0 top
R15  33.02,55.88 180 top
R16  33.02,58.42 0 top
R17  33.02,60.96 0 top
R18  33.02,63.5 180 top
R19  33.02,66.04 0 top
R20  32.38,20.95 270 top
R21  32.38,24.77 270 top
R22  114.3,13.97 180 top
R23  96.52,3.81 0 top
R24  109.22,3.81 180 top
R25  105.41,22.86 270 top
R26  33.66,14.61 0 bottom
R27  59.69,20.32 90 top
R28  56.52,20.32 90 top
R29  60.96,29.21 180 bottom
R30  60.96,27.3 180 bottom
R31  34.92,20.95 90 top
R32  107.31,68.58 180 top
R33  33.66,12.7 0 bottom
R34  33.66,10.16 0 bottom
R35  33.66,12.06 90 bottom
R36  130.81,33.02 90 bottom
R37  128.27,33.02 270 bottom
R38  64.77,45.72 180 bottom
R39  64.77,43.81 0 bottom
R40  119.38,18.41 180 top
R41  114.3,17.78 180 top
R42  75.56,2.54 0 top
R43  100.33,59.05 0 bottom
R44  100.33,60.96 180 bottom
R45  39.37,60.33 180 top
R46  33.02,68.58 0 top
S1  40.01,5.08 180 top
S2  46.99,48.26 0 bottom
SJ1  64.77,27.3 180 bottom
SJ2  64.77,29.21 180 bottom
SJ3  111.76,68.58 0 top
SJ4  71.75,2.54 180 top
SJ5  143.51,21.59 180 top
SW1  102.87,12.7 0 top
T1  117.47,22.23 180 top
T2  64.77,15.24 180 top
T3  64.77,5.08 180 top
T4  39.37,57.15 270 top
T5  39.37,63.5 270 top
U1  115.57,52.07 270 bottom
U$3  54.61,49.53 90 top
U$4  [ESD_10.00]  146.05,38.73 90 top
U$5  [CS-2016-LOGO-10MM]  73.66,44.45 0 top
X1  26.67,5.08 270 top
X2  26.67,25.4 270 top
X3  26.67,66.04 270 top
X4  26.67,35.56 270 top
X5  26.67,50.8 270 top
X6  26.67,15.24 270 top

### Tracks (layer width: path | path; a pad name or v marks a point on that pad's centre or on a via)
!RESET  (via drill 0.35)
  Top 1.016: v81.28,34.29 82.55,35.56 IC1.!RESET | S1.1 S1.2 43.66,7.08 45.69,5.05 49.56,5.05 50.48,4.13 C14.1 51.12,1.27 v66.04,1.27
  Bottom 1.016: v81.28,34.29 80.01,33.02 80.01,12.06 79.38,11.43 76.2,11.43 v66.04,1.27
+3V3  (via drill 0.35)
  Top 0.508: IC2.5 59.05,27.3 v58.42,26.67
  Top 1.016: R14.1 v30.48,53.34 29.84,52.7 29.84,43.81 30.48,43.18 v31.11,43.18 | R17.1 v30.48,60.96 | v93.98,3.81 R23.1 | v104.14,41.91 104.14,25.08 R25.1 106.36,23.81 v109.54,20.64 110.14,20.04 110.14,16.76 112.04,14.85 112.04,13.97 | C15.1 42.55,65.08 v42.55,64.77 | v53.98,19.05 54.61,19.68 54.61,22.23 v55.24,22.86 58.42,26.04 v58.42,26.67 | C16.1 39.31,19.05 J2.1 37.2,20 R31.1 | R24.1 111.12,3.81 v112.04,4.73 112.04,13.97 | R22.2 112.04,13.97 | IC1.+3V3 91.44,40.64 v96.52,45.72 | v109.22,45.72 v109.22,55.24 109.22,55.88 109.22,57.15 109.22,63.5 LCD1.23 LCD1.22 113.03,65.72 C1.1 113.35,68.58 SJ3.2 | v120.65,27.94 v127,27.94 | v137.16,27.94 137.79,27.94 138.43,28.57 138.43,45.72 140.97,48.26 JP3.1 | v30.48,67.31 31.75,68.58 R46.1 | R45.1 v41.91,60.33
  Bottom 0.508: SJ1.2 65.53,24.64 66.04,24.13 66.04,22.88 65.71,22.55 55.55,22.55 v55.24,22.86 | U1.3 111.44,53.02 v109.22,55.24
  Bottom 1.016: v30.48,53.34 v30.48,60.96 | 43.18,62.15 31.67,62.15 v30.48,60.96 | 43.18,62.15 53.26,62.15 54.61,62.15 | v93.98,3.81 99.32,3.81 99.34,3.79 111.1,3.79 v112.04,4.73 | 104.14,44.45 105.41,45.72 v109.22,45.72 | v31.11,43.18 31.11,38.73 36.83,33.02 36.83,20.32 38.67,18.48 | v104.14,41.91 104.14,44.45 | 54.61,62.15 72.47,62.15 73.57,61.05 81.19,61.05 v96.52,45.72 102.87,45.72 104.14,44.45 | v42.55,64.77 42.55,62.78 43.18,62.15 | U$3.J1.5 v58.42,26.67 | SJ2.2 SJ1.2 | 38.67,18.48 J2.1 | 38.67,18.48 53.4,18.48 v53.98,19.05 | 54.61,62.15 55.24,62.78 U$3.J2.3 | v109.54,20.64 116.84,27.94 v120.65,27.94 | 127.61,28.55 v127,27.94 127.61,28.55 | v137.16,27.94 136.55,28.55 127.61,28.55 | v30.48,60.96 v30.48,67.31 | v41.91,60.33 43.18,61.59 43.18,62.15 | C28.1 143.19,48.26 JP3.1
+5V  (via drill 0.35)
  Top 1.016: R1.1 95.57,23.81 v95.25,24.13 | 131.7,17.4 LED3.1-VDD | C8.1 132.13,9.26 132.13,10.79 | 132.13,10.79 131.87,11.05 LED2.1-VDD 129.69,11.05 128.52,9.88 127.36,9.88 124.46,6.99 124.46,3.81 123.83,3.17 116.2,3.17 115,4.38 J1.4 | 131.7,17.4 132.13,16.97 132.13,10.79 | 131.7,17.4 132.13,17.83 132.13,24.13 C9.1 132.12,24.49 132.12,27.9 129.54,30.48 v110.49,30.48
  Bottom 0.508: S2.3 49.21,47.31 50.78,45.74 50.8,45.74
  Bottom 1.016: 50.8,45.74 57.62,45.74 61.31,49.43 83.03,49.43 86.74,45.72 IC1.+5V 91.44,45.72 95.25,41.91 95.25,30.48 | v110.49,30.48 95.25,30.48 | 95.25,30.48 v95.25,24.13
+UB_INTERN  (via drill 0.35)
  Top 1.016: F2.2 39.62,31.36 35.56,27.3 v35.56,25.4 | IC3.3 41.67,44.53 | 41.67,44.53 C18.1 | D2.2 35.71,45.09 36.2,45.09 36.83,44.45 36.83,43.18 37.47,42.55 41.27,42.55 41.91,43.18 41.91,44.29 41.67,44.53 | D3.2 60.48,8.56 K1.6 | D4.2 60.48,11.76 K1.7 | v73.66,10.79 82.69,10.79 C23.+ 83.96,11.29 v85.09,10.16
  Top 1.27: F2.2 40.4,31.75 43.26,31.75 47.32,35.81 47.32,39.75 42.54,44.53 41.67,44.53
  Bottom 1.016: X6.1 26.7,17.83 30.48,21.61 33.04,21.61 33.66,22.23 33.66,23.5 v35.56,25.4 35.56,18.41 43.81,10.16 58.42,10.16 | K1.6 58.88,10.16 | 58.88,10.16 K1.7 | 58.88,10.16 58.42,10.16 | 58.42,10.16 60.99,10.16 61.62,10.79 v73.66,10.79 | v85.09,10.16 92.71,2.54 122.56,2.54 124.46,4.45 124.46,6.99 125.73,8.26 131.44,8.26 138.43,15.24 DC1.2
CNTRL_PH1
  Top 1.016: R5.2 68.9,21.27 IC1.D2
CNTRL_PH2
  Top 1.016: R7.2 66.67,11.74 66.67,15.6 67.44,16.36 67.44,17.14 68.07,17.78 IC1.D3
EMERGENCY_STOP
  Top 1.016: R20.1 R21.2 35.88,23.82 36.83,24.77 36.83,26.29 39.11,28.57 43.18,28.57 45.09,30.48 45.09,31.75 47.62,34.29 66.04,34.29 67.31,33.02 IC1.A4
ENCODER_1
  Top 1.016: SW1.A 98.86,5.2 R23.2 97.47,5.08 96.52,6.04 C11.1 93.98,6.04 93.34,5.4 88.58,5.4 87.63,6.35 87.63,13.97 88.9,15.24 IC1.D7
ENCODER_2
  Top 1.016: C12.1 108.27,4.45 R24.2 107,5.08 105.49,5.08 SW1.B 101.07,9.5 100.33,9.5 93.37,9.5 IC1.D6
ENCODER_BTN  (via drill 0.35)
  Top 1.016: C13.1 102.87,21.91 | 102.87,21.91 R25.2 105.41,19.74 SW1.E | IC1.A6 72.39,27.94 86.36,41.91 86.36,44.7 89.92,48.26 v96.52,48.26 | v101.6,48.26 v101.6,34.29 | 102.87,21.91 v102.87,31.75
  Bottom 1.016: v96.52,48.26 v101.6,48.26 | v102.87,31.75 102.87,32.38 101.6,33.66 v101.6,34.29
ENDSTOP
  Top 1.016: D7.2 D8.2 73.66,12.7 72.39,11.43 72.39,5.59 71.12,4.32 71.12,2.67 SJ4.2
ENDSTOP_BOTTOM  (via drill 0.35)
  Top 1.016: T5.C 36.83,63.5 | R17.2 34.29,60.96 36.83,63.5 | v77.47,45.72 77.47,51.18 74.13,54.53 49.61,54.53 40.64,63.5 36.83,63.5 | D8.1 v78.74,12.7
  Bottom 1.016: 77.47,19.05 77.47,20.32 | 77.47,20.32 v77.47,45.72 | 77.47,19.05 77.47,20.32 | 77.47,19.05 77.47,18.67 71.5,12.7 | IC1.D5 71.5,12.7 | v78.74,12.7 71.5,12.7
ENDSTOP_TOP  (via drill 0.35)
  Top 1.016: T4.C 36.83,57.15 | 36.83,57.15 35.56,55.88 35.56,54.61 34.29,53.34 R14.2 | v76.2,44.45 76.2,50.8 73.66,53.34 48.9,53.34 45.09,57.15 36.83,57.15 | D7.1 77.47,15.39 77.47,17.78 v76.2,19.05
  Bottom 1.016: v76.2,44.45 v76.2,19.05 72.39,15.24 IC1.D4
GND  (via drill 0.35)
  other vias: 35.56,49.53 36.83,49.53 38.1,49.53 113.67,10.16 40.64,49.53 41.91,49.53 115.57,52.7
  pour Top (rank 2): -1.27,71.12 151.13,71.12 151.13,0 -1.27,0
  pour Bottom (rank 2): -1.27,71.12 151.13,71.12 151.13,0 -1.27,0
HGB_ON  (via drill 0.35)
  Top 1.016: R3.2 121.92,23.5 121.28,24.13 v120.65,24.13 | IC1.D0 74.04,25.4 v85.28,14.16
  Bottom 1.016: v120.65,24.13 114.68,24.13 100.08,9.53 92.71,9.53 91.44,10.79 88.64,10.79 v85.28,14.16
I2C_SCL  (via drill 0.35)
  Top 0.508: v117.08,49.53 117.08,41.53 116.56,41.02 116.56,39.73 116.2,39.37
  Top 1.016: v79.82,45.91 79.82,50.61 70.74,59.69 53.98,59.69 53.34,60.33 | JP1.2 53.34,60.33 | U$3.J2.1 50.16,63.5 53.34,60.33 | IC1.D12 91.44,27.94 v97.16,33.66 | v113.67,39.37 116.2,39.37 121.54,39.37 123.98,41.81 133.25,41.81 v133.35,41.91
  Bottom 0.508: U1.5 116.37,52.07 115.87,51.56 115.87,50.06 116.4,49.53 v117.08,49.53
  Bottom 1.016: IC1.D12 83.82,34.29 83.82,41.27 79.82,45.28 v79.82,45.91 | v133.35,41.91 144.78,41.91 146.05,43.18 JP3.3 | v113.67,39.37 112.39,38.1 101.6,38.1 v97.16,33.66
I2C_SCL_2  (via drill 0.35)
  Top 0.508: IC2.4 66.04,27.48 v66.04,31.75
  Bottom 1.016: JP2.2 U$3.J1.3 53.34,33.02 55.88,35.56 61.59,35.56 64.24,32.92 65.25,32.92 65.94,32.23 65.94,31.85 v66.04,31.75
I2C_SDA  (via drill 0.35)
  Top 0.508: v116.3,47.94 116.3,46.47 v114.94,45.1
  Top 1.016: v55.88,60.96 54.61,60.96 52.7,62.87 U$3.J2.2 | v55.88,60.96 57.15,60.96 | 57.15,60.96 71.12,60.96 81.28,50.8 v81.28,41.91 | v55.88,60.96 57.15,60.96 | IC1.D11 91.44,25.4 95.89,29.84 v99.06,33.02 | v133.35,40.64 124.46,40.64 121.92,38.1 118.11,38.1 v114.3,38.1
  Bottom 0.508: U1.4 117.5,53.02 118.15,52.37 118.15,49.5 117.4,48.75 116.7,48.75 116.2,48.26 116.2,48.03 v116.3,47.94 | 114.2,38.2 114.94,38.94 v114.94,45.1
  Bottom 1.016: v81.28,41.91 82.65,40.54 82.65,33.81 87.63,28.83 87.63,27.94 IC1.D11 | JP1.1 v55.88,60.96 | v99.06,33.02 100.33,34.29 100.33,35.18 101.98,36.83 113.03,36.83 114.2,38 114.2,38.2 v114.3,38.1 | v133.35,40.64 JP3.4
I2C_SDA_2  (via drill 0.35)
  Top 0.508: IC2.3 65.41,26.04 64.77,26.67 v64.77,31.75
  Bottom 1.016: JP2.1 U$3.J1.4 55.88,33.02 57.15,34.29 61.22,34.29 63.76,31.75 v64.77,31.75
LCD_!CS
  Top 1.016: LCD1.28 97.79,39.37 91.44,33.02 IC1.D14
LCD_!RST
  Top 1.016: LCD1.27 100.33,39.37 91.44,30.48 IC1.D13
LCD_CD
  Top 1.016: LCD1.26 102.87,33.4 97.74,28.27 97.16,28.27 96.48,27.59 96.48,27.01 92.33,22.86 IC1.D10
LDR  (via drill 0.35)
  Top 1.016: R12.1 C7.1 39.35,21.59 J2.2 37.8,21.91 R31.2 | IC1.A1 69.12,40.64 68.4,41.36 62.95,41.36 60.96,39.37 v58.42,39.37
  Bottom 1.016: v58.42,39.37 58.17,39.37 57,38.2 51.28,38.2 44.45,31.37 44.45,25.4 40.02,20.98 J2.2
LED  (via drill 0.35)
  Top 1.016: IC1.A3 77.47,35.56 85.09,43.18 85.09,45.09 89.53,49.53 v96.52,49.53 | v106.68,49.53 106.68,25.4 111.44,20.64 111.44,17.14 112.72,15.88 R13.2
  Bottom 1.016: v96.52,49.53 v106.68,49.53
LED_OUT  (via drill 0.35)
  Top 1.016: LED3.2-DOUT 129.54,20.7 129.28,20.7 v128.27,19.68
  Bottom 1.016: v128.27,19.68 128.27,17.14 117.5,6.37 J1.3
LM317_ADJ  (via drill 0.35)
  Top 1.016: v118.11,54.61 118.11,41.27 v117.47,40.64 | 130.81,38.73 130.49,39.05 | 130.49,39.05 130.07,39.47 124.94,39.47 122.3,36.83 v121.28,36.83 | 130.49,39.05 130.81,38.73 | 130.81,38.73 LM317.1
  Bottom 0.508: R43.2 98.42,59.05 97.79,59.69 97.79,61.59 98.45,62.25 107.35,62.25 IC4.1
  Bottom 1.016: IC4.1 112.39,60.33 v118.11,54.61 | v117.47,40.64 118.11,40.01 118.11,38.53 119.81,36.83 v121.28,36.83
  Bottom 1.27: R37.1 R36.2 LM317.1
LM317_OUT  (via drill 0.35)
  Top 1.27: LM317.2 128.27,35.56 v132.08,31.75
  Bottom 0.508: v133.99,54.61 134.12,54.75
  Bottom 1.016: LM317.2 128.27,39.37 128.27,41.91 | 128.27,41.91 128.27,43.18 | 128.27,43.18 v128.91,43.18 | v127.64,43.18 128.27,43.18 | 128.27,41.91 120.29,41.91 D6.A | v133.99,52.07 137.16,52.07 138.43,53.34 C26.+
  Bottom 1.27: C22.1 120.33,42.2 D6.A | v132.08,31.75 131.76,32.07 R36.1
  other vias: 122.56,54.61 122.56,53.34 122.56,52.07 122.56,50.8 122.56,49.53 122.56,48.26 122.56,46.99 122.56,45.72 122.56,44.45 122.56,43.18 123.83,43.18 125.09,43.18 126.36,43.18 130.18,43.18 131.44,43.18 132.72,43.18 133.99,43.18 133.99,44.45 133.99,45.72 133.99,46.99 133.99,48.26 133.99,49.53 133.99,50.8 133.99,53.34 133.35,39.37 133.35,38.1 133.35,36.83 133.35,35.56 123.19,35.56 138.43,54.75
  pour Bottom: 119.38,60.96 134.62,60.96 134.62,34.92 121.92,34.92 121.92,38.73 118.11,38.73 118.11,44.45 119.38,44.45
  pour Top: 121.28,60.96 134.62,60.96 134.62,34.92 121.28,34.92
N$1
  Top 1.016: K1.4 52.7,7.13 Q1.8 Q1.7 50.8,18.16 Q1.6 Q1.5
N$2
  Top 1.016: R9.2 R8.2 Q1.4
N$3
  Top 1.016: C3.1 119.7,65.72 LCD1.19
N$4  (via drill 0.35)
  Top 1.016: C3.2 v123.19,67.31
  Bottom 1.016: v123.19,67.31 125.73,67.31 LCD1.16
N$5
  Top 1.016: C2.1 124.78,66.36 LCD1.18
N$6
  Top 1.016: C2.2 126.68,65.72 LCD1.17
N$7
  Top 1.016: C4.2 131.76,65.72 LCD1.15
N$8  (via drill 0.35)
  Top 1.016: LED1.14 130.81,27.3 128.91,29.21 v110.49,29.21
  Bottom 1.016: LED1.2 102.87,29.21 v110.49,29.21
N$9
  Top 1.016: LED1.1 97.79,23.18 R1.2
N$10
  Top 1.016: LED1.13 119.38,26.67 117.47,24.77 T1.C | T1.C 117.47,20.95 T1.C
N$11
  Top 1.016: T1.B 118.97,23.27 119.38,22.86 119.38,21.59 120.33,20.64 R3.1 R2.1
N$12
  Top 1.016: R4.1 R5.1 66.04,17.45 T2.B
N$13
  Top 1.016: R6.1 R7.1 66.27,8.98 T3.B
N$14
  Bottom 2.54: X1.2 29.87,5.74 45.26,5.74 K1.3
N$15
  Top 1.016: F1.1 42.3,11.82 41.91,11.43
  Top 2.54: K1.2 44.55,11.43 41.91,11.43
N$16
  Top 2.54: F1.2 31.12,12.06 X1.1
N$17
  Top 2.54: F2.1 36.44,39.76 34.16,42.04 D1.K
N$18
  Top 1.016: R13.1 120.02,15.88 120.65,15.24 120.65,12.7 122.3,11.05 LED2.4-DIN
N$19
  Top 1.016: LED2.2-DOUT 129.16,14.35 126.11,17.4 LED3.4-DIN
N$20
  Top 1.016: R15.1 R16.2 34.2,58.65 T4.B 37.39,59.29 R45.2
N$21
  Top 1.016: R15.2 30.48,55.88 28.57,53.98 28.57,40 X4.2
N$22
  Top 1.016: T5.B 36.6,65 35.56,66.04 R19.2 | R19.2 R18.1 | R46.2 R19.2
N$23
  Top 1.016: R18.2 30.48,63.5 29.21,62.23 29.21,57.15 26.7,54.63 X5.2
N$24  (via drill 0.35)
  Top 0.508: v64.77,24.13 65.41,23.5 IC2.1
  Bottom 0.508: R30.2 SJ1.1 64.28,27.03 64.28,24.62 v64.77,24.13
N$25  (via drill 0.35)
  Top 0.508: v67.36,24.18 66.77,24.77 IC2.2
  Bottom 0.508: R29.2 SJ2.1 64.01,29.72 64.77,30.48 66.22,30.48 66.52,30.18 66.52,25.02 v67.36,24.18
N$26  (via drill 0.35)
  Top 0.508: R28.1 56.52,17 K1.1
  Top 1.016: v35.56,16.65 35.7,16.51 39.37,16.51 v39.52,16.36
  Bottom 1.016: v35.56,16.65 35.15,16.25 R26.1 R33.1 R34.1 35.15,9.75 R35.1
  Bottom 1.27: K1.1 v39.52,16.36
N$27  (via drill 0.35)
  Top 1.016: R20.2 v32.38,18.41
  Bottom 1.016: v32.38,18.41 31.11,18.41 26.7,13.99 X6.2
N$28
  Top 1.016: LED4.A R32.2
N$29  (via drill 0.35)
  Top 1.016: C25.+ 123.05,16.65 v121.92,17.78 121.28,18.41 R40.1
  Bottom 1.016: D5.K 121.92,32.89 v121.92,17.78
  Bottom 1.27: LM317.3 125.73,35.56 124.46,34.29 120.78,34.29 D5.K 116.82,38 116.82,39.47 116.18,40.1 116.18,46.06 C21.1
N$30
  Top 1.016: R32.1 SJ3.1
N$31
  Bottom 0.508: U1.1 111.64,51.12 107.31,55.44 107.31,57.15 107.95,57.78 IC4.3
N$32
  Top 1.016: LED5.A 79.06,2.54 R42.2
N$33
  Top 1.016: R42.1 SJ4.1
N$34
  Bottom 1.016: IC1.AREF R38.2 R39.1
N$35  (via drill 0.35)
  Top 0.508: v113.67,50.16 114.3,50.8 114.3,53.34 118.77,57.81 118.77,60.98 119.38,61.59 134.62,61.59 135.25,60.96 135.25,26.37 140.34,21.29 DC1.4
  Bottom 0.508: IC4.8 105.11,60.33 106.66,58.78 106.66,55.17 111.66,50.16 v113.67,50.16
  Bottom 1.016: C30.1 C29.1 140.01,20 DC1.4
N$36
  Bottom 0.508: IC4.2 107.31,59.05 106.68,59.69 106.68,60.96 106.05,61.59 101.92,61.59 R44.2 R43.1
N$37  (via drill 0.35)
  Top 0.508: v114.3,56.52 116.54,56.52 118.11,58.08 118.11,61.26 119.11,62.25 134.89,62.25 135.91,61.23 135.91,26.65 140.97,21.59 SJ5.2
  Top 1.016: SJ5.2 142.75,20.19 DC1.3
  Bottom 0.508: IC4.4 v114.3,56.52
  Bottom 1.016: C30.2 C29.2 140.01,18.1 DC1.3
PH1
  Top 1.016: K1.8 60.96,14.96 | 60.96,14.96 64.77,14.96 T2.C | D4.1 60.96,14.96
PH2
  Top 1.016: T3.C 64.77,5.08 60.96,5.08 | 60.96,5.08 59.16,5.08 K1.5 | D3.1 60.96,5.08
PH_ON  (via drill 0.35)
  Top 1.016: v46.99,28.57 47.94,28.57 R8.1
  Bottom 1.016: IC1.D1 67.31,22.86 66.04,21.59 50.8,21.59 46.99,25.4 v46.99,28.57
RTC_32K
  Top 1.016: 32K.PIN1 49.53,29.21 48.26,30.48 U$3.J1.1
RTC_INT
  Bottom 1.016: U$3.J1.2 52.17,33.12 52.17,33.5 55.5,36.83 61.97,36.83 62.74,36.07 65.28,36.07 67.31,38.1 IC1.A2
SENSITIVITY  (via drill 0.35)
  Top 1.016: C6.1 44.69,26.59 v43.18,26.59 | v62.42,45.53 63.94,47.05 74.87,47.05 v74.93,46.99 | v83.19,45.72 88.27,50.8 v96.52,50.8 | v99.06,50.8 v99.06,40.01 | v114.3,21.59 112.14,21.59 109.22,24.51 v109.22,39.37
  Bottom 1.016: J2.3 40.06,23.48 v43.18,26.59 43.18,31.75 50.8,39.37 56.26,39.37 v62.42,45.53 | v74.93,46.99 75.02,47.08 82.09,47.08 83.19,45.98 v83.19,45.72 | v96.52,50.8 v99.06,50.8 | v99.06,40.01 99.69,39.37 v109.22,39.37 | v114.3,21.59 115.57,20.32 115.57,17.78 118.11,15.24 123.57,15.24 127,18.67 127,20.95 128.91,22.86 136.27,22.86 141.35,27.94 JP3.9
SHUNT_+  (via drill 0.35)
  Top 0.508: v63.5,24.13 62.87,23.5 IC2.8 59.69,22.4 R27.2
  Bottom 0.508: C17.1 62.55,24.13 v63.5,24.13
SHUNT_-  (via drill 0.35)
  Top 0.508: v63.5,25.4 62.87,24.77 IC2.7 59.08,24.77 56.52,22.2 R28.2
  Bottom 0.508: v63.5,25.4 62.75,26.15 61.33,26.15 60.86,25.68 60.86,25.61 C17.2
SOLAR_+  (via drill 0.35)
  Top 1.27: v110.85,42.55 110.85,35.2 v111.12,34.92
  Bottom 1.27: X3.1 27.31,69.22 90.81,69.22 93.98,66.04 93.98,60.96 101.6,53.34 106.68,53.34 110.85,49.17 v110.85,42.55 | D5.A 111.89,34.16 v111.12,34.92
  Bottom 2.54: D9.C 19.05,60.96 X3.1
SPI_MOSI  (via drill 0.35)
  Top 1.016: LCD1.24 107.95,53.34 v107.95,27.94
  Bottom 1.016: v107.95,27.94 107.95,19.05 106.68,17.78 IC1.D8
SPI_SCK  (via drill 0.35)
  Top 1.016: LCD1.25 v105.41,27.94
  Bottom 1.016: v105.41,27.94 105.41,27.18 98.55,20.32 IC1.D9
UBAT_ADC  (via drill 0.35)
  Top 1.016: R10.2 C5.1 R11.1 36.65,33.02 36.65,33.63 38.02,35 v38.02,35.48 | v45.72,43.18 54.61,52.07 v72.39,52.07 | v87.63,52.07 95.25,52.07 96.52,53.34 v96.52,62.23 | v115.57,60.96 112.39,57.78 112.39,36.2 116.84,31.75 v123.19,31.75
  Bottom 1.016: v38.02,35.48 v45.72,43.18 | JP3.7 146.69,33.02 145.31,31.65 141.76,31.65 139.83,29.72 125.22,29.72 v123.19,31.75 | v72.39,52.07 v87.63,52.07 | v96.52,62.23 97.75,63.46 103.5,63.46 113.07,63.46 v115.57,60.96
USER_BTN  (via drill 0.35)
  Top 1.016: v72.39,24.13 73.66,24.13 86.36,11.43 86.36,4.06 88.02,2.4 111.62,2.4 113.54,4.32 113.54,7.49 115.25,9.21 C10.1 | R22.1 C10.1 | J1.1 122.5,6.72 117.16,12.06 C10.1
  Bottom 1.016: IC1.A5 71.12,30.48 71.75,29.84 71.75,24.77 v72.39,24.13
USOLAR_ADC  (via drill 0.35)
  Top 1.016: R40.2 v116.84,18.41 115.89,18.41 115.25,19.05 | C27.1 115.25,19.05 | R41.1 115.25,19.05
  Bottom 1.016: v116.84,18.41 118.75,16.51 123.19,16.51 125.73,19.05 125.73,21.59 128.27,24.13 135.89,24.13 142.24,30.48 JP3.8
VBAT  (via drill 0.35)
  Top 0.508: v50.8,15.2 50.76,15.24 42.32,15.24 36.83,15.24 34.29,15.24 R35.2 | v59.69,17.78 R27.1
  Top 1.016: R10.1 30.53,27.94 30.48,27.89 | D1.A 35.4,36.64 38.5,36.64 38.95,36.2 v45.72,36.2 | v62.34,47.1 66.04,50.8 v73.66,50.8
  Top 1.27: X2.1 30.48,27.96 30.48,27.89 30.48,17.78 30.48,17.37 v31.34,16.51
  Top 2.54: v30.48,35.56 34.01,35.56 D1.A
  Bottom 0.508: v50.8,15.2 52.07,15.2 52.11,15.2 52.7,14.61 56.52,14.61 v59.69,17.78
  Bottom 1.016: v45.72,36.2 50.16,40.64 55.88,40.64 v62.34,47.1 | v73.66,50.8 89.79,50.8 96.04,44.55 96.42,44.55 100.33,40.64 100.59,40.64 113.03,40.64 D6.K
  Bottom 1.27: v31.34,16.51 32.16,15.7 | 32.16,15.7 R26.2 R33.2 R34.2 | R35.2 32.33,15.88 32.16,15.7
  Bottom 2.54: X2.1 30.48,31.75 v30.48,35.56
VCC  (via drill 0.35)
  Top 1.016: 39.37,50.8 IC3.2 39.37,46.71 38.1,45.44 v38.1,44.45 | 39.37,50.8 C19.1 C20.1 33.97,47.46 D2.1 | 39.37,50.8 IC3.4 | C24.+ 80.15,53.58 82.45,51.28 82.45,48.37 v82.87,47.94
  Bottom 1.016: 63.5,48.26 61.79,48.26 57.98,44.45 v38.1,44.45 | 63.5,48.26 82.55,48.26 v82.87,47.94 87.63,43.18 IC1.VIN | IC1.VIN 91.44,43.18 IC1.VIN | R38.1 63.82,47.94 63.5,48.26
VCC_CTRL  (via drill 0.35)
  Top 1.016: v61.5,42.01 59.69,43.81 59.69,44.45 v57.15,46.99
  Bottom 0.508: S2.1 49.85,49.21 52.07,46.99
  Bottom 1.016: IC1.A0 67.94,43.18 66.77,42.01 v61.5,42.01 | 52.07,46.99 v57.15,46.99
VCC_SWITCH
  Bottom 1.016: S2.4 45.74,47.01 44.45,45.72 29.21,45.72 | 29.21,45.72 X4.1 | X5.1 29.21,55.93 29.21,45.72

### Text on the board
tPlace: Solar / max. 20W | 3,3V | - + | Display | Endstop / Bottom | RTC - DS3231 | GND SW +5V | Endstop / Top | GND SW +5V | Hühnerklappen-Steuerung / F.Flüthmann / 04/21 / v2 | - + | Batterie | 14V DC max. | Status | LDR / POT | Notaus | Fehler | Reset | Motor | BUTTON / LED | Endstop
bPlace: VCC SWITCH | SHUNT
bNames: VDD / GND / SCL / SDA / ADDR / ALRT / A0 / A1 / A2 / A3